# Altium project PCB_Project_MOPA_D.PrjPcb (part 1 of 2)
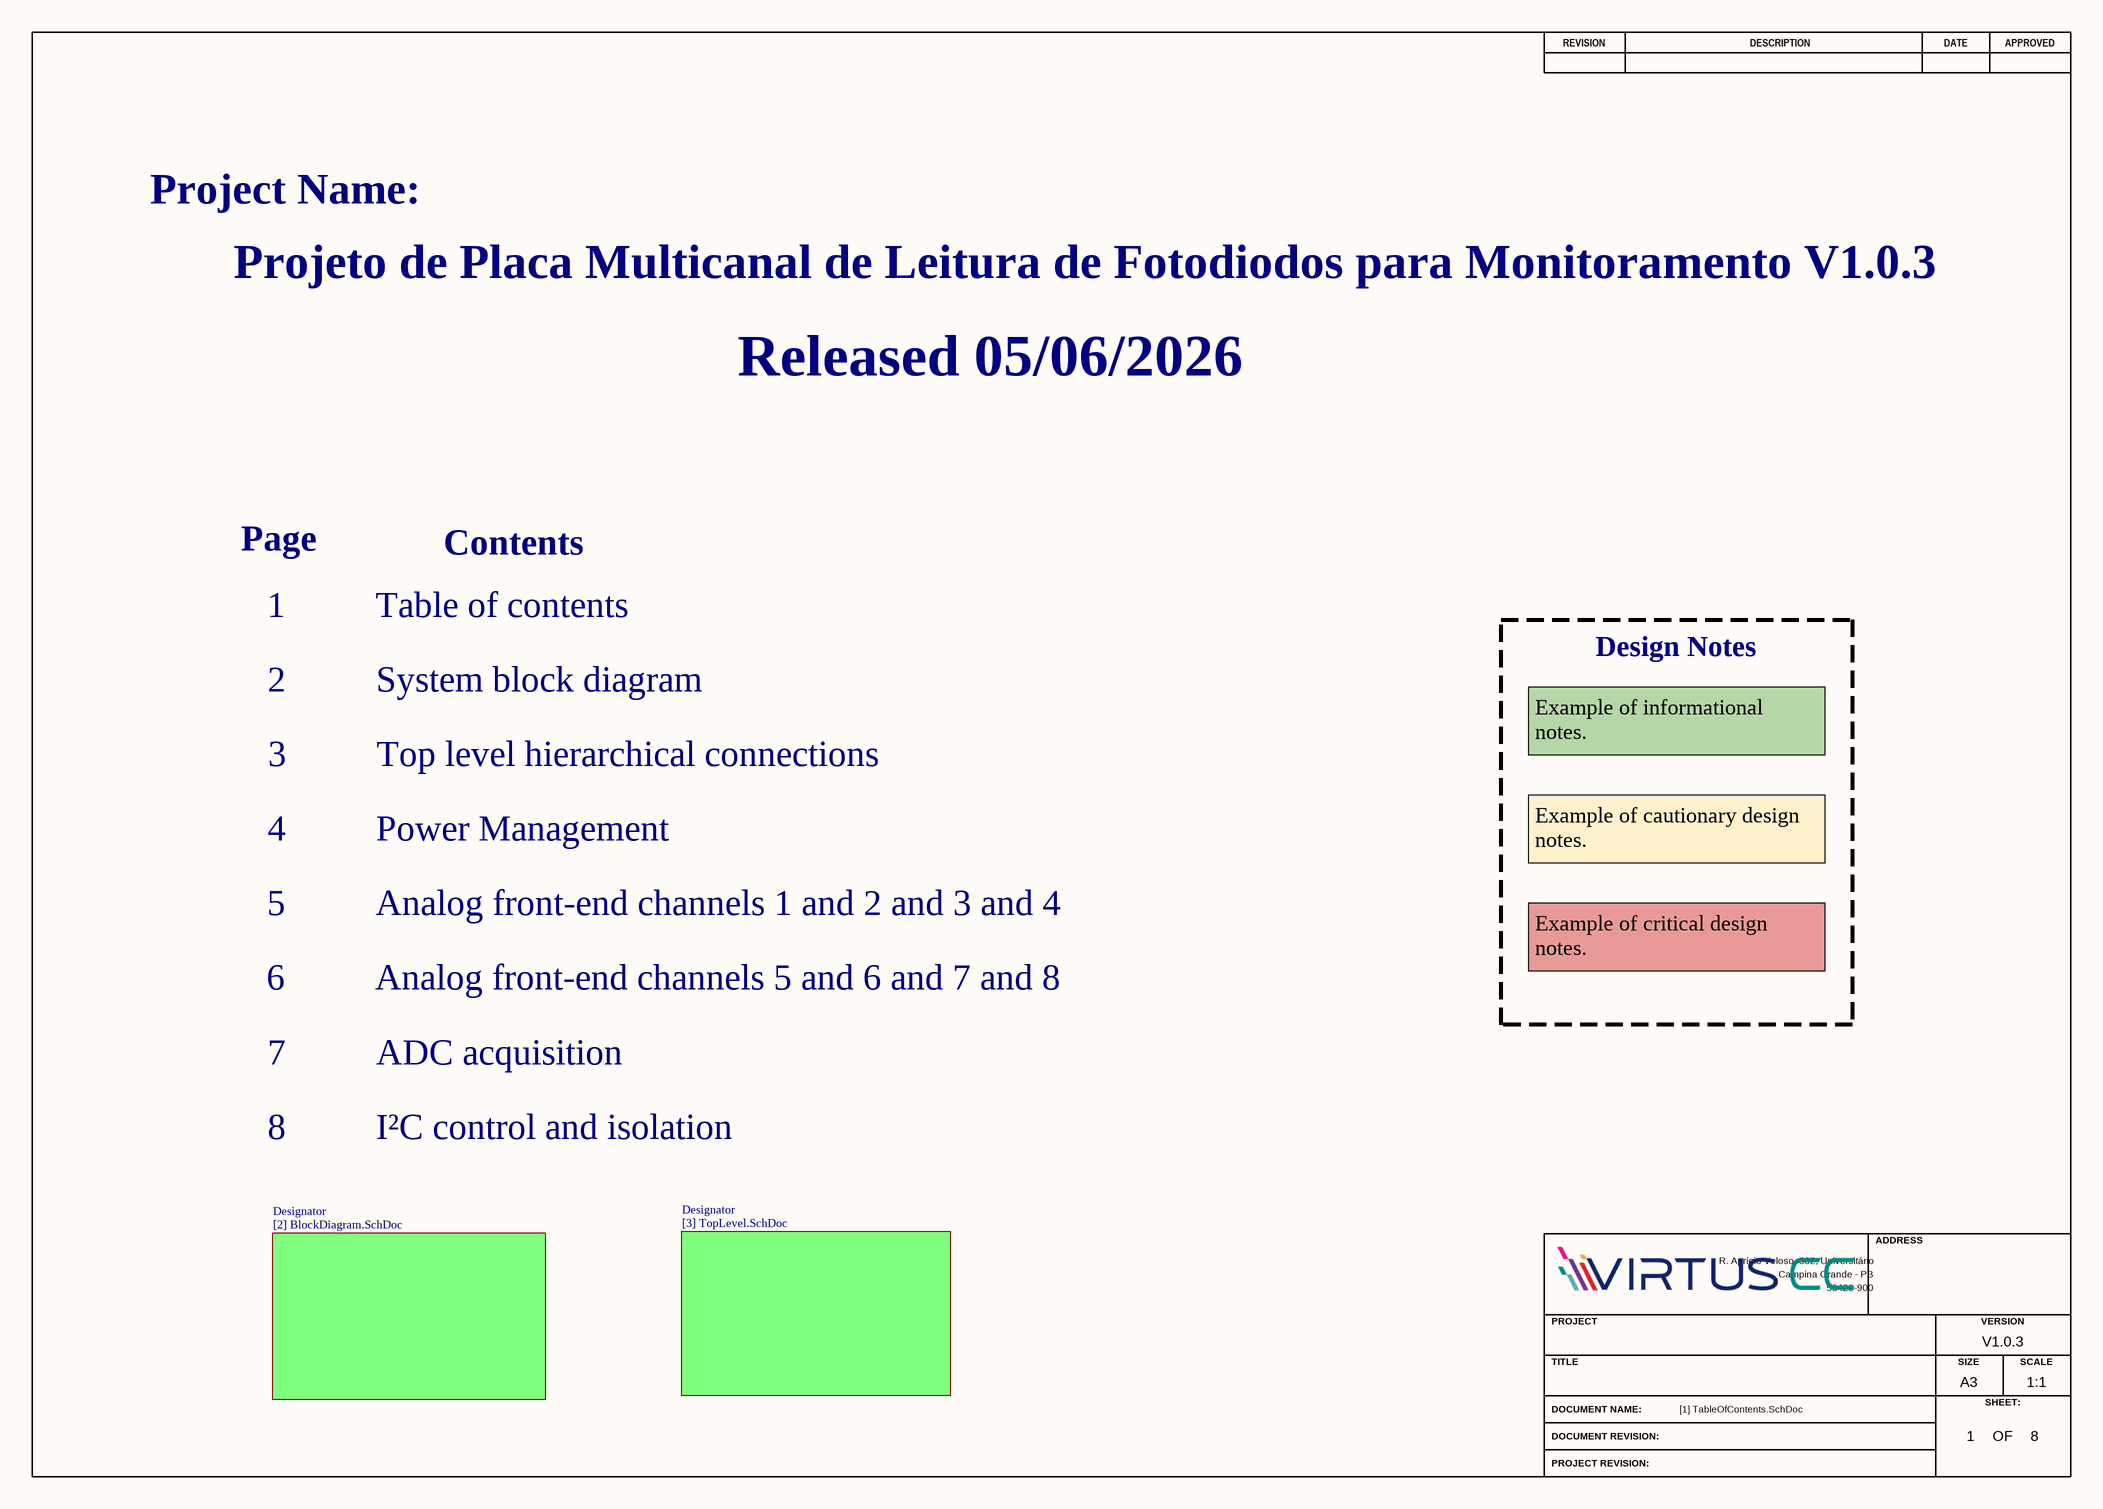
[diagram p0: [1] TableOfContents.SchDoc]
Version: V1.0.3
8 sheets, 129 parts. Net scope: hierarchical (ports join the sheet entries above them; power ports are global).
Board file: PCB_MOPA.PcbDoc
Sheets:
  [1] TableOfContents.SchDoc
    Designator = [2] BlockDiagram.SchDoc
    Designator = [3] TopLevel.SchDoc
      [5] AnalogChannels_1_2_3_4 = [5] AnalogChannels_1_2_3_4.SchDoc
      [6] AnalogChannels_5_6_7_8 = [6] AnalogChannels_5_6_7_8.SchDoc
      [4] PowerManagement = [4] PowerManagement.SchDoc
      [8] I2C_Control = [8] I2C_Control.SchDoc
      [7] ADC_Acquisition = [7] ADC_Acquisition.SchDoc

## Sheet [1] TableOfContents.SchDoc: =DocumentName
size A3; Organization: ORGANIZATION; Address1: R. Aprígio Veloso, 882, Universitário; Address2: Campina Grande - PB; Address3: 58429-900; DocumentNumber: 1; Revision: -; SheetNumber: 1; SheetTotal: 8; Project: PCB_Project_MOPA_D.PrjPcb; ENG_DATE: --/--/--; DSN_DATE: --/--/--; CHK_DATE: --/--/--; SCH_SCALE: 1:1

### Sub-sheets
Designator = [2] BlockDiagram.SchDoc: no entries
Designator = [3] TopLevel.SchDoc: no entries

### Notes on the sheet
- Project Name:
- Released 05/06/2026
- Page
- Contents
- 1          Table of contents
- Design Notes
- 2          System block diagram
- 3          Top level hierarchical connections
- Example of informational notes.
- 4          Power Management
- Example of cautionary design notes.
- 5          Analog front-end channels 1 and 2 and 3 and 4
- 6          Analog front-end channels 5 and 6 and 7 and 8
- Example of critical design notes.
- 7          ADC acquisition
- 8          I²C control and isolation
- REVISION
- DESCRIPTION
- DATE
- APPROVED
- ADDRESS
- PROJECT
- VERSION
- TITLE
- A3
- SIZE
- SCALE
- DOCUMENT NAME:
- DOCUMENT REVISION:
- OF
- SHEET:
- PROJECT REVISION:

## Sheet [2] BlockDiagram.SchDoc: =DocumentName
size A3; Organization: ORGANIZATION; Address1: R. Aprígio Veloso, 882, Universitário; Address2: Campina Grande - PB; Address3: 58429-900; DocumentNumber: 2; Revision: -; SheetNumber: 2; SheetTotal: 8; Project: PCB_Project_MOPA_D.PrjPcb; ENG_DATE: --/--/--; DSN_DATE: --/--/--; CHK_DATE: --/--/--; SCH_SCALE: 1:1
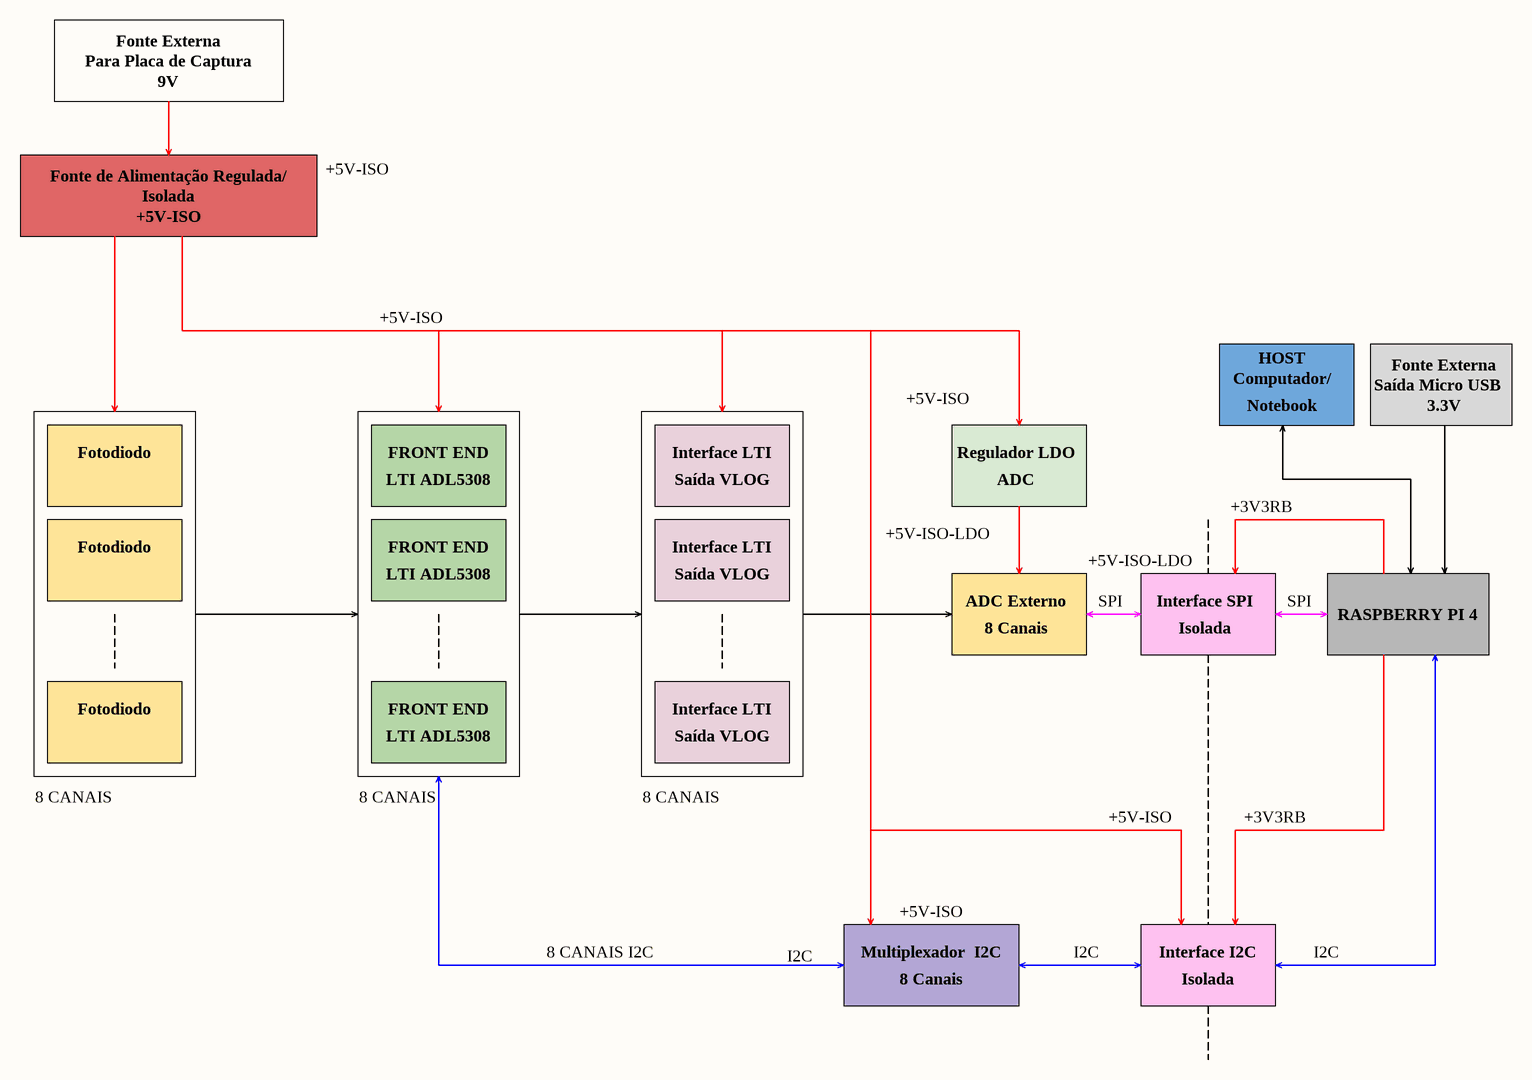
[diagram p1: [2] BlockDiagram.SchDoc]

### Notes on the sheet
- Fonte Externa
- Para Placa de Captura
- 9V
- Fonte de Alimentação Regulada/
- Isolada
- +5V-ISO
- HOST
- Computador/
- Notebook
- Saída Micro USB
- 3.3V
- Fotodiodo
- FRONT END
- LTI ADL5308
- Interface LTI
- Saída VLOG
- Regulador LDO
- ADC
- +5V-ISO-LDO
- +3V3RB
- ADC Externo
- SPI
- Interface SPI
- RASPBERRY PI 4
- 8 Canais
- 8 CANAIS
- 8 CANAIS I2C
- I2C
- Multiplexador  I2C
- Interface I2C
- REVISION
- DESCRIPTION
- DATE
- APPROVED
- ADDRESS
- PROJECT
- VERSION
- TITLE
- A3
- SIZE
- SCALE
- DOCUMENT NAME:
- DOCUMENT REVISION:
- OF
- SHEET:
- PROJECT REVISION:

## Sheet [3] TopLevel.SchDoc: =DocumentName
size A3; Organization: ORGANIZATION; Address1: R. Aprígio Veloso, 882, Universitário; Address2: Campina Grande - PB; Address3: 58429-900; DocumentNumber: 3; Revision: -; SheetNumber: 3; SheetTotal: 8; Project: PCB_Project_MOPA_D.PrjPcb; ENG_DATE: --/--/--; DSN_DATE: --/--/--; CHK_DATE: --/--/--; SCH_SCALE: 1:1
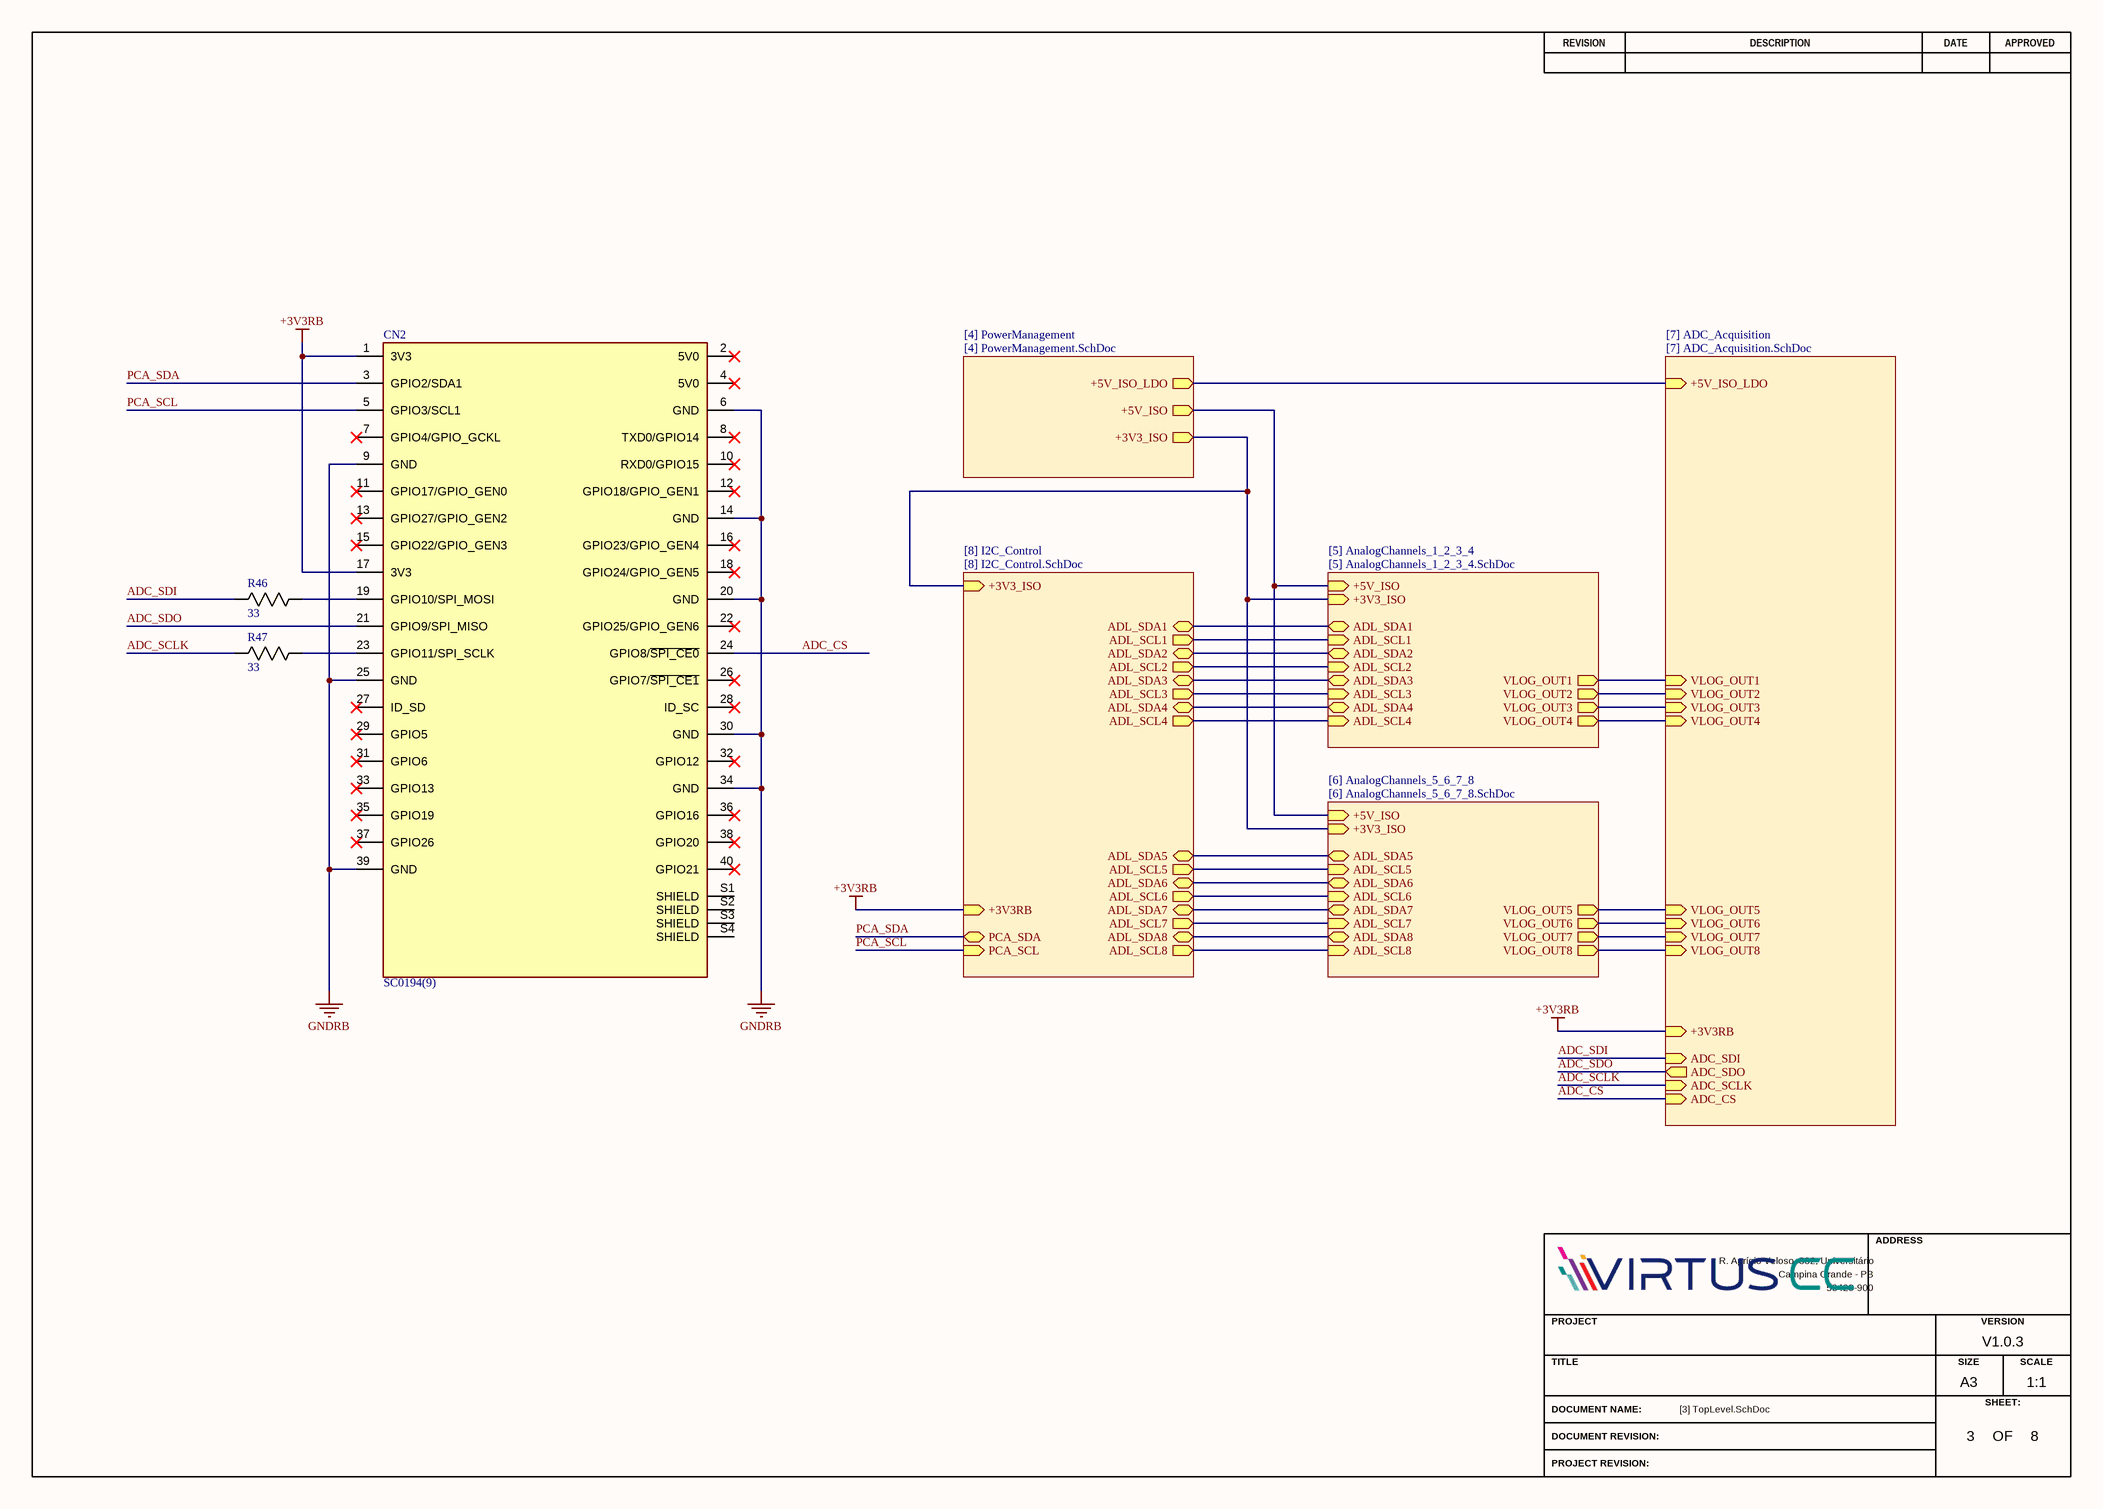
[diagram p2: [3] TopLevel.SchDoc]

### Parts
CN2  SC0194(9)  [RPI_SHIELD_CONNECTOR]
R46  value 33  [RESC1005X40N]  (hidden comment: RC0402FR-0733RL)
R47  value 33  [RESC1005X40N]  (hidden comment: RC0402FR-0733RL)

### Sub-sheets
[4] PowerManagement = [4] PowerManagement.SchDoc: +5V_ISO_LDO (out), +5V_ISO (out), +3V3_ISO (out)
[5] AnalogChannels_1_2_3_4 = [5] AnalogChannels_1_2_3_4.SchDoc: VLOG_OUT3 (out), ADL_SCL3 (in), ADL_SCL2 (in), VLOG_OUT1 (out), +5V_ISO (in), ADL_SCL4 (in), VLOG_OUT2 (out), ADL_SDA3 (bidir), ADL_SDA2 (bidir), VLOG_OUT4 (out), ADL_SCL1 (in), ADL_SDA1 (bidir), ADL_SDA4 (bidir), +3V3_ISO (in)
[6] AnalogChannels_5_6_7_8 = [6] AnalogChannels_5_6_7_8.SchDoc: +5V_ISO (in), ADL_SDA5 (bidir), ADL_SCL8 (in), ADL_SCL6 (in), ADL_SDA6 (bidir), ADL_SDA7 (bidir), ADL_SDA8 (bidir), VLOG_OUT6 (out), ADL_SCL7 (in), ADL_SCL5 (in), VLOG_OUT5 (out), VLOG_OUT7 (out), VLOG_OUT8 (out), +3V3_ISO (in)
[7] ADC_Acquisition = [7] ADC_Acquisition.SchDoc: VLOG_OUT1 (in), VLOG_OUT7 (in), VLOG_OUT6 (in), VLOG_OUT2 (in), +5V_ISO_LDO (in), VLOG_OUT8 (in), VLOG_OUT5 (in), VLOG_OUT3 (in), VLOG_OUT4 (in), ADC_SDO (out), +3V3RB (in), ADC_CS (in), ADC_SDI (in), ADC_SCLK (in)
[8] I2C_Control = [8] I2C_Control.SchDoc: ADL_SDA5 (bidir), ADL_SCL3 (out), ADL_SCL1 (out), ADL_SDA4 (bidir), ADL_SCL6 (out), ADL_SDA8 (bidir), ADL_SCL8 (out), ADL_SCL4 (out), ADL_SDA7 (bidir), ADL_SDA2 (bidir), ADL_SDA1 (bidir), ADL_SCL2 (out), ADL_SDA3 (bidir), ADL_SDA6 (bidir), ADL_SCL5 (out), ADL_SCL7 (out), PCA_SDA (bidir), PCA_SCL (in), +3V3RB (in), +3V3_ISO (in)

### Nets
+3V3_ISO: sheet [5] AnalogChannels_1_2_3_4/+3V3_ISO, sheet [6] AnalogChannels_5_6_7_8/+3V3_ISO, sheet [4] PowerManagement/+3V3_ISO, sheet [8] I2C_Control/+3V3_ISO
+3V3RB: CN2.1(3V3) CN2.17(3V3) ; sheet [8] I2C_Control/+3V3RB, sheet [7] ADC_Acquisition/+3V3RB
+5V_ISO: sheet [5] AnalogChannels_1_2_3_4/+5V_ISO, sheet [6] AnalogChannels_5_6_7_8/+5V_ISO, sheet [4] PowerManagement/+5V_ISO
+5V_ISO_LDO: sheet [4] PowerManagement/+5V_ISO_LDO, sheet [7] ADC_Acquisition/+5V_ISO_LDO
GNDRB: CN2.6(GND) CN2.9(GND) CN2.14(GND) CN2.20(GND) CN2.25(GND) CN2.30(GND) CN2.34(GND) CN2.39(GND)
ADC_CS: CN2.24(GPIO8/~{SPI_CE0}) ; sheet [7] ADC_Acquisition/ADC_CS
ADC_SCLK: R47.2 ; sheet [7] ADC_Acquisition/ADC_SCLK
ADC_SDI: R46.2 ; sheet [7] ADC_Acquisition/ADC_SDI
ADC_SDO: CN2.21(GPIO9/SPI_MISO) ; sheet [7] ADC_Acquisition/ADC_SDO
PCA_SCL: CN2.5(GPIO3/SCL1) ; sheet [8] I2C_Control/PCA_SCL
PCA_SDA: CN2.3(GPIO2/SDA1) ; sheet [8] I2C_Control/PCA_SDA
VLOG_OUT1: sheet [5] AnalogChannels_1_2_3_4/VLOG_OUT1, sheet [7] ADC_Acquisition/VLOG_OUT1
VLOG_OUT2: sheet [5] AnalogChannels_1_2_3_4/VLOG_OUT2, sheet [7] ADC_Acquisition/VLOG_OUT2
VLOG_OUT3: sheet [5] AnalogChannels_1_2_3_4/VLOG_OUT3, sheet [7] ADC_Acquisition/VLOG_OUT3
VLOG_OUT4: sheet [5] AnalogChannels_1_2_3_4/VLOG_OUT4, sheet [7] ADC_Acquisition/VLOG_OUT4
VLOG_OUT5: sheet [6] AnalogChannels_5_6_7_8/VLOG_OUT5, sheet [7] ADC_Acquisition/VLOG_OUT5
VLOG_OUT6: sheet [6] AnalogChannels_5_6_7_8/VLOG_OUT6, sheet [7] ADC_Acquisition/VLOG_OUT6
VLOG_OUT7: sheet [6] AnalogChannels_5_6_7_8/VLOG_OUT7, sheet [7] ADC_Acquisition/VLOG_OUT7
VLOG_OUT8: sheet [6] AnalogChannels_5_6_7_8/VLOG_OUT8, sheet [7] ADC_Acquisition/VLOG_OUT8
NetCN2_19: CN2.19(GPIO10/SPI_MOSI) R46.1
NetCN2_23: CN2.23(GPIO11/SPI_SCLK) R47.1
NetR7_2: sheet [5] AnalogChannels_1_2_3_4/ADL_SCL2, sheet [8] I2C_Control/ADL_SCL2
NetR8_2: sheet [5] AnalogChannels_1_2_3_4/ADL_SDA2, sheet [8] I2C_Control/ADL_SDA2
NetR9_2: sheet [5] AnalogChannels_1_2_3_4/ADL_SCL1, sheet [8] I2C_Control/ADL_SCL1
NetR10_2: sheet [5] AnalogChannels_1_2_3_4/ADL_SDA1, sheet [8] I2C_Control/ADL_SDA1
NetR15_2: sheet [5] AnalogChannels_1_2_3_4/ADL_SCL4, sheet [8] I2C_Control/ADL_SCL4
NetR16_2: sheet [5] AnalogChannels_1_2_3_4/ADL_SDA4, sheet [8] I2C_Control/ADL_SDA4
NetR17_2: sheet [5] AnalogChannels_1_2_3_4/ADL_SCL3, sheet [8] I2C_Control/ADL_SCL3
NetR18_2: sheet [5] AnalogChannels_1_2_3_4/ADL_SDA3, sheet [8] I2C_Control/ADL_SDA3
NetR23_2: sheet [6] AnalogChannels_5_6_7_8/ADL_SCL5, sheet [8] I2C_Control/ADL_SCL5
NetR24_2: sheet [6] AnalogChannels_5_6_7_8/ADL_SDA5, sheet [8] I2C_Control/ADL_SDA5
NetR25_2: sheet [6] AnalogChannels_5_6_7_8/ADL_SCL6, sheet [8] I2C_Control/ADL_SCL6
NetR26_2: sheet [6] AnalogChannels_5_6_7_8/ADL_SDA6, sheet [8] I2C_Control/ADL_SDA6
NetR31_2: sheet [6] AnalogChannels_5_6_7_8/ADL_SCL8, sheet [8] I2C_Control/ADL_SCL8
NetR32_2: sheet [6] AnalogChannels_5_6_7_8/ADL_SDA8, sheet [8] I2C_Control/ADL_SDA8
NetR33_2: sheet [6] AnalogChannels_5_6_7_8/ADL_SCL7, sheet [8] I2C_Control/ADL_SCL7
NetR34_2: sheet [6] AnalogChannels_5_6_7_8/ADL_SDA7, sheet [8] I2C_Control/ADL_SDA7

Not connected (* = marked no-connect by the designer): CN2 2(5V0)* 4(5V0)* 7(GPIO4/GPIO_GCKL)* 8(TXD0/GPIO14)* 10(RXD0/GPIO15)* 11(GPIO17/GPIO_GEN0)* 12(GPIO18/GPIO_GEN1)* 13(GPIO27/GPIO_GEN2)* 15(GPIO22/GPIO_GEN3)* 16(GPIO23/GPIO_GEN4)* 18(GPIO24/GPIO_GEN5)* 22(GPIO25/GPIO_GEN6)* 26(GPIO7/~{SPI_CE1})* 27(ID_SD)* 28(ID_SC)* 29(GPIO5)* 31(GPIO6)* 32(GPIO12)* 33(GPIO13)* 35(GPIO19)* 36(GPIO16)* 37(GPIO26)* 38(GPIO20)* 40(GPIO21)* S1(SHIELD) S2(SHIELD) S3(SHIELD) S4(SHIELD)

### Notes on the sheet
- REVISION
- DESCRIPTION
- DATE
- APPROVED
- ADDRESS
- PROJECT
- VERSION
- TITLE
- A3
- SIZE
- SCALE
- DOCUMENT NAME:
- DOCUMENT REVISION:
- OF
- SHEET:
- PROJECT REVISION:

### Library data of the parts
CN2 = SC0194(9): The Raspberry Pi 4 Model B SC0194(9) single board computer features a Broadcom BCM2711 ARM Cortex-A72 quad-core processor operating at 1.5GHz, making it a powerful choice for embedded computing applications. Equipped with 4GB of RAM and a variety of conne; SnapEDA_Link: https://www.snapeda.com/parts/SC0194(9)/Raspberry+Pi/view-part/?ref=snap; Package: None; Value: *; MF: Raspberry Pi; MP: SC0194(9); Check_prices: https://www.snapeda.com/parts/SC0194(9)/Raspberry+Pi/view-part/?ref=eda
R46 R47 = RC0402FR-0733RL: 33 Ohms ±1% 0.063W, 1/16W Chip Resistor 0402 (1005 Metric) Moisture Resistant Thick Film; Manufacturer_Name: Yageo; Copyright: Copyright (C) 2025 Ultra Librarian. All rights reserved.; Manufacturer_Part_Number: RC0402FR-0733RL; Supplier 1: DigiKey; Supplier Part Number 1: 311-33.0LRCT-ND; Datasheet Link: https://yageogroup.com/content/datasheet/asset/file/PYU-RC_GROUP_51_ROHS_L

## Sheet [5] AnalogChannels_1_2_3_4.SchDoc: =DocumentName
size A3; Organization: ORGANIZATION; Address1: R. Aprígio Veloso, 882, Universitário; Address2: Campina Grande - PB; Address3: 58429-900; DocumentNumber: 5; Revision: -; SheetNumber: 5; SheetTotal: 8; Project: PCB_Project_MOPA_D.PrjPcb; ENG_DATE: --/--/--; DSN_DATE: --/--/--; CHK_DATE: --/--/--; SCH_SCALE: 1:1
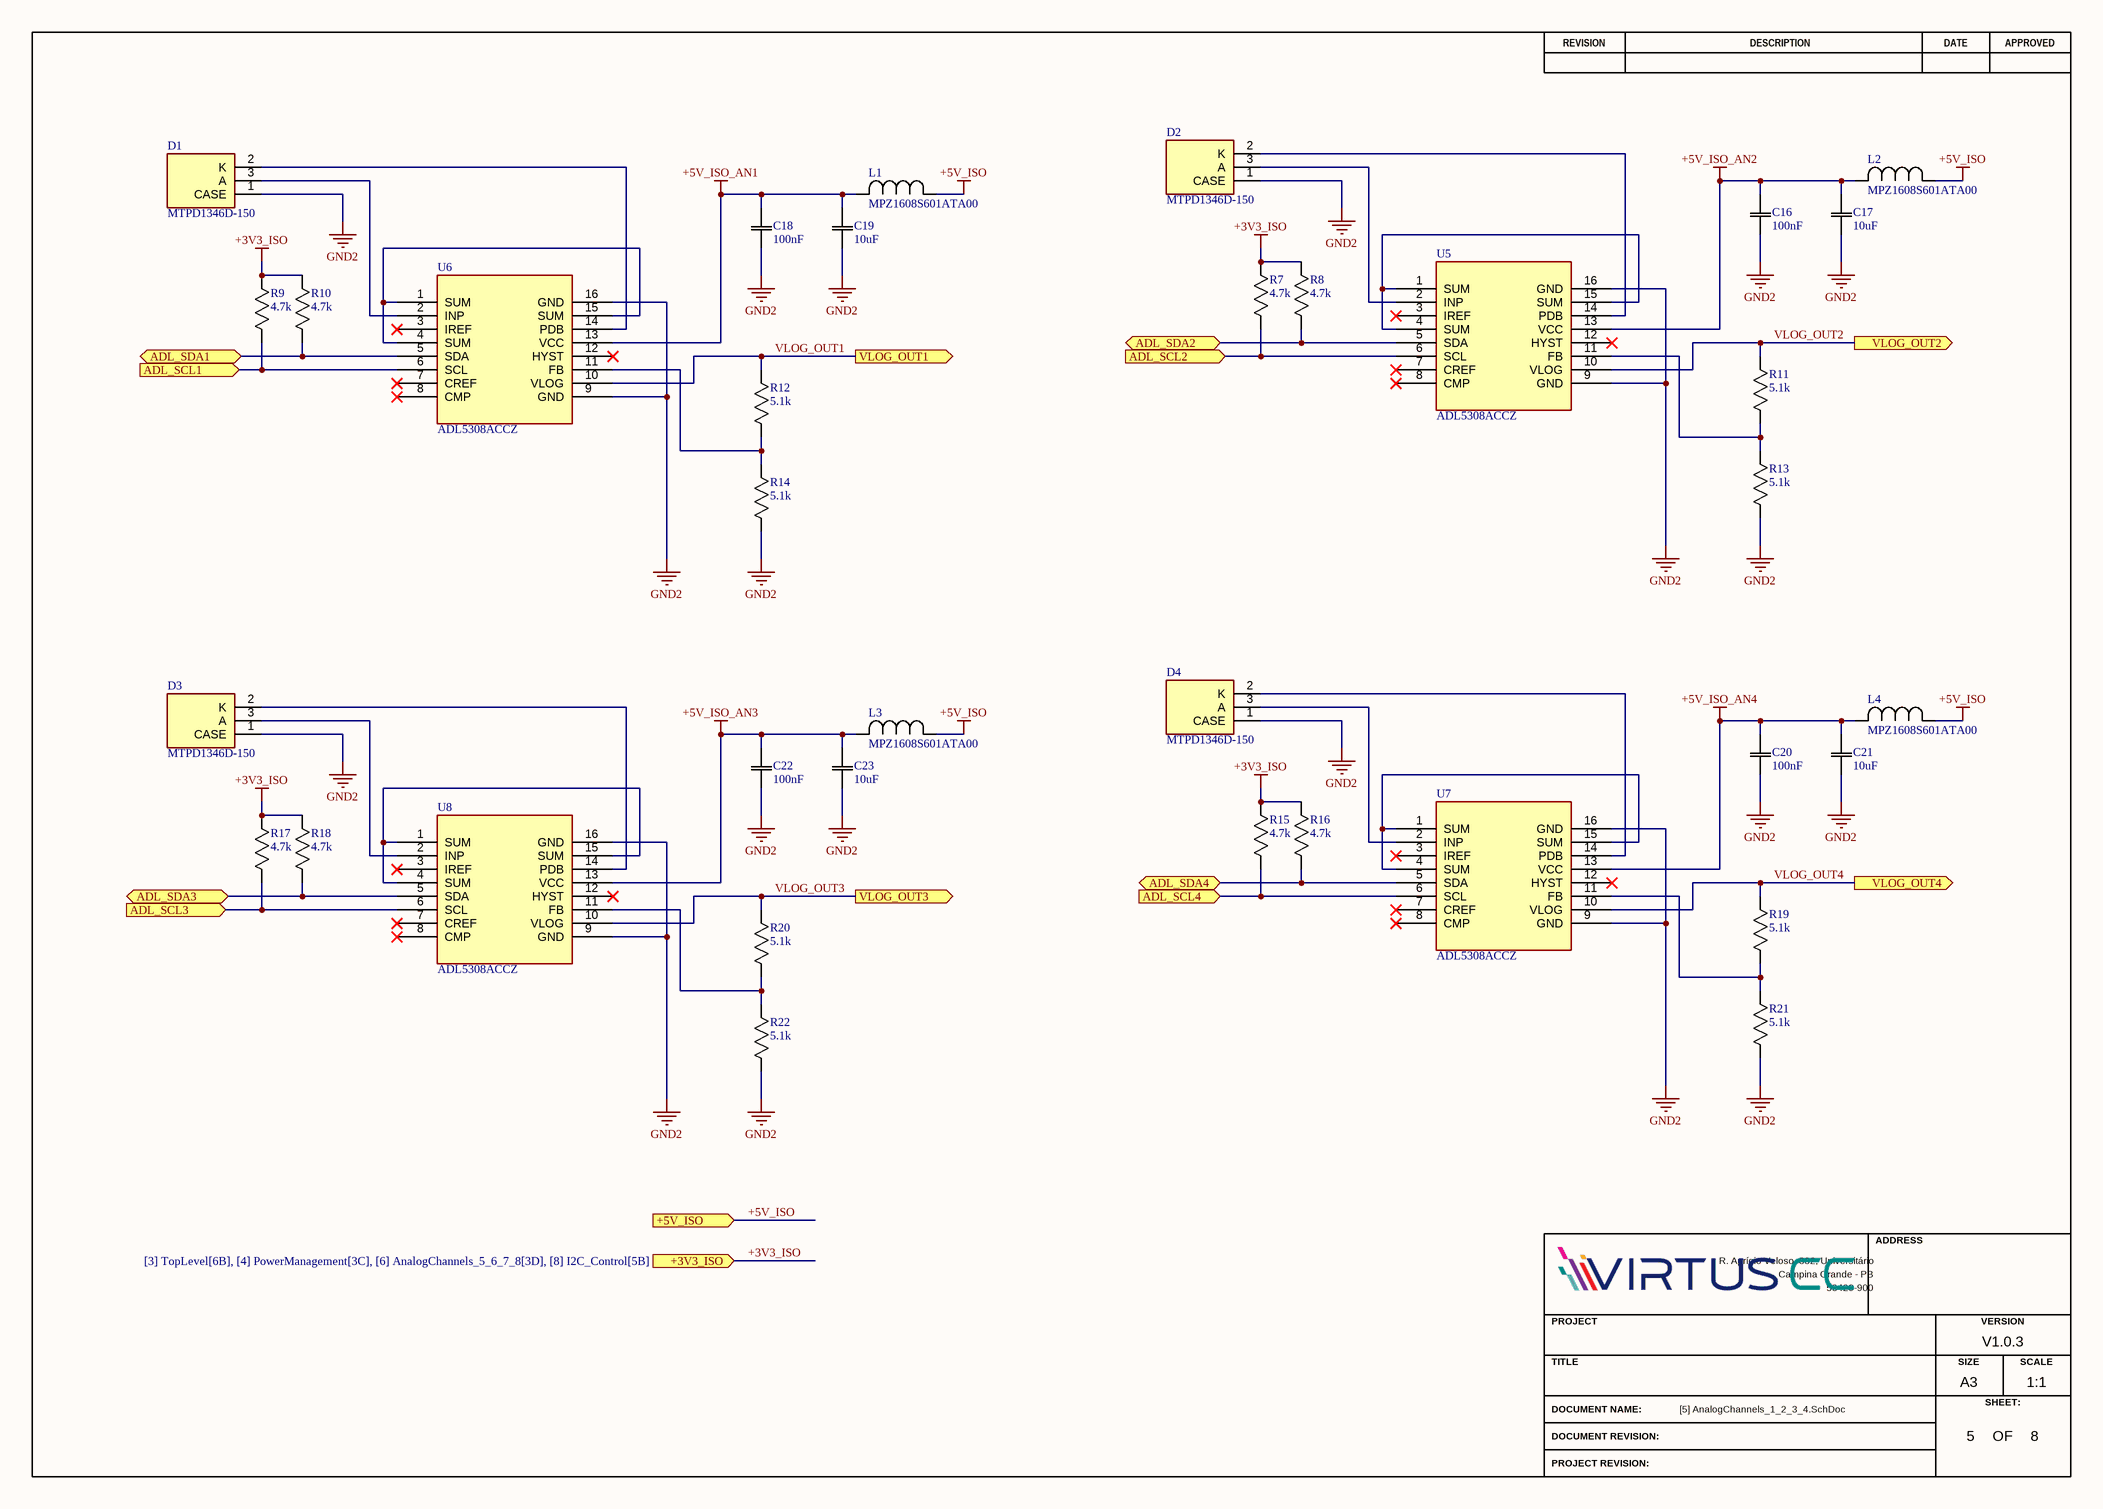
[diagram p3: [5] AnalogChannels_1_2_3_4.SchDoc]

### Parts
C16  value 100nF  [CAPC1005X40N]  (hidden comment: GCM155R71H104KE02D)
C17  value 10uF  [CAPC1005X40N]  (hidden comment: GRT155R61A106ME13D)
C18  value 100nF  [CAPC1005X40N]  (hidden comment: GCM155R71H104KE02D)
C19  value 10uF  [CAPC1005X40N]  (hidden comment: GRT155R61A106ME13D)
C20  value 100nF  [CAPC1005X40N]  (hidden comment: GCM155R71H104KE02D)
C21  value 10uF  [CAPC1005X40N]  (hidden comment: GRT155R61A106ME13D)
C22  value 100nF  [CAPC1005X40N]  (hidden comment: GCM155R71H104KE02D)
C23  value 10uF  [CAPC1005X40N]  (hidden comment: GRT155R61A106ME13D)
D1  MTPD1346D-150  [TO127P540X1680-3N]
D2  MTPD1346D-150  [TO127P540X1680-3N]
D3  MTPD1346D-150  [TO127P540X1680-3N]
D4  MTPD1346D-150  [TO127P540X1680-3N]
L1  MPZ1608S601ATA00  [INDC1608X06N]
L2  MPZ1608S601ATA00  [INDC1608X06N]
L3  MPZ1608S601ATA00  [INDC1608X06N]
L4  MPZ1608S601ATA00  [INDC1608X06N]
R7  value 4.7k  [RESC1005X40N]  (hidden comment: RC0402FR-074K7L)
R8  value 4.7k  [RESC1005X40N]  (hidden comment: RC0402FR-074K7L)
R9  value 4.7k  [RESC1005X40N]  (hidden comment: RC0402FR-074K7L)
R10  value 4.7k  [RESC1005X40N]  (hidden comment: RC0402FR-074K7L)
R11  value 5.1k  [RESC1005X40N]  (hidden comment: RC0402FR-075K1L)
R12  value 5.1k  [RESC1005X40N]  (hidden comment: RC0402FR-075K1L)
R13  value 5.1k  [RESC1005X40N]  (hidden comment: RC0402FR-075K1L)
R14  value 5.1k  [RESC1005X40N]  (hidden comment: RC0402FR-075K1L)
R15  value 4.7k  [RESC1005X40N]  (hidden comment: RC0402FR-074K7L)
R16  value 4.7k  [RESC1005X40N]  (hidden comment: RC0402FR-074K7L)
R17  value 4.7k  [RESC1005X40N]  (hidden comment: RC0402FR-074K7L)
R18  value 4.7k  [RESC1005X40N]  (hidden comment: RC0402FR-074K7L)
R19  value 5.1k  [RESC1005X40N]  (hidden comment: RC0402FR-075K1L)
R20  value 5.1k  [RESC1005X40N]  (hidden comment: RC0402FR-075K1L)
R21  value 5.1k  [RESC1005X40N]  (hidden comment: RC0402FR-075K1L)
R22  value 5.1k  [RESC1005X40N]  (hidden comment: RC0402FR-075K1L)
U5  ADL5308ACCZ  [CC-14-4_ADI]
U6  ADL5308ACCZ  [CC-14-4_ADI]
U7  ADL5308ACCZ  [CC-14-4_ADI]
U8  ADL5308ACCZ  [CC-14-4_ADI]

### Ports
+3V3_ISO (in, see [3] TopLevel[6B], [4] PowerManagement[3C], [6] AnalogChannels_5_6_7_8[3D], [8] I2C_Control[5B]), +5V_ISO (in, see [3] TopLevel[6B], [4] PowerManagement[4B], [6] AnalogChannels_5_6_7_8[3D]), ADL_SCL1 (in, see [3] TopLevel[6B], [8] I2C_Control[3A]), ADL_SCL2 (in, see [3] TopLevel[6B], [8] I2C_Control[3B]), ADL_SCL3 (in, see [3] TopLevel[6B], [8] I2C_Control[3B]), ADL_SCL4 (in, see [3] TopLevel[6B], [8] I2C_Control[3B]), ADL_SDA1 (bidir, see [3] TopLevel[6B], [8] I2C_Control[3A]), ADL_SDA2 (bidir, see [3] TopLevel[6B], [8] I2C_Control[3B]), ADL_SDA3 (bidir, see [3] TopLevel[6B], [8] I2C_Control[3B]), ADL_SDA4 (bidir, see [3] TopLevel[6B], [8] I2C_Control[3B]), VLOG_OUT1 (out, see [3] TopLevel[7B], [7] ADC_Acquisition[3A]), VLOG_OUT2 (out, see [3] TopLevel[7B], [7] ADC_Acquisition[3A]), VLOG_OUT3 (out, see [3] TopLevel[7B], [7] ADC_Acquisition[3A]), VLOG_OUT4 (out, see [3] TopLevel[7B], [7] ADC_Acquisition[3A])

### Nets
+3V3_ISO: R7.1 R8.1 R9.1 R10.1 R15.1 R16.1 R17.1 R18.1 ; port +3V3_ISO
+5V_ISO: L1.1 L2.1 L3.1 L4.1 ; port +5V_ISO
+5V_ISO_AN1: C18.2 C19.2 L1.2 U6.13(VCC)
+5V_ISO_AN2: C16.2 C17.2 L2.2 U5.13(VCC)
+5V_ISO_AN3: C22.2 C23.2 L3.2 U8.13(VCC)
+5V_ISO_AN4: C20.2 C21.2 L4.2 U7.13(VCC)
GND2: C16.1 C17.1 C18.1 C19.1 C20.1 C21.1 C22.1 C23.1 D1.1(CASE) D2.1(CASE) D3.1(CASE) D4.1(CASE) R13.2 R14.2 R21.2 R22.2 U5.9(GND) U5.16(GND) U6.9(GND) U6.16(GND) U7.9(GND) U7.16(GND) U8.9(GND) U8.16(GND)
VLOG_OUT1: R12.1 U6.10(VLOG) ; port VLOG_OUT1
VLOG_OUT2: R11.1 U5.10(VLOG) ; port VLOG_OUT2
VLOG_OUT3: R20.1 U8.10(VLOG) ; port VLOG_OUT3
VLOG_OUT4: R19.1 U7.10(VLOG) ; port VLOG_OUT4
NetD1_2: D1.2(K) U6.14(PDB)
NetD1_3: D1.3(A) U6.2(INP)
NetD2_2: D2.2(K) U5.14(PDB)
NetD2_3: D2.3(A) U5.2(INP)
NetD3_2: D3.2(K) U8.14(PDB)
NetD3_3: D3.3(A) U8.2(INP)
NetD4_2: D4.2(K) U7.14(PDB)
NetD4_3: D4.3(A) U7.2(INP)
NetR7_2: R7.2 U5.6(SCL) ; port ADL_SCL2
NetR8_2: R8.2 U5.5(SDA) ; port ADL_SDA2
NetR9_2: R9.2 U6.6(SCL) ; port ADL_SCL1
NetR10_2: R10.2 U6.5(SDA) ; port ADL_SDA1
NetR11_2: R11.2 R13.1 U5.11(FB)
NetR12_2: R12.2 R14.1 U6.11(FB)
NetR15_2: R15.2 U7.6(SCL) ; port ADL_SCL4
NetR16_2: R16.2 U7.5(SDA) ; port ADL_SDA4
NetR17_2: R17.2 U8.6(SCL) ; port ADL_SCL3
NetR18_2: R18.2 U8.5(SDA) ; port ADL_SDA3
NetR19_2: R19.2 R21.1 U7.11(FB)
NetR20_2: R20.2 R22.1 U8.11(FB)
NetU5_1: U5.1(SUM) U5.4(SUM) U5.15(SUM)
NetU6_1: U6.1(SUM) U6.4(SUM) U6.15(SUM)
NetU7_1: U7.1(SUM) U7.4(SUM) U7.15(SUM)
NetU8_1: U8.1(SUM) U8.4(SUM) U8.15(SUM)

Not connected (* = marked no-connect by the designer): U5 3(IREF)* 7(CREF)* 8(CMP)* 12(HYST)*; U6 3(IREF)* 7(CREF)* 8(CMP)* 12(HYST)*; U7 3(IREF)* 7(CREF)* 8(CMP)* 12(HYST)*; U8 3(IREF)* 7(CREF)* 8(CMP)* 12(HYST)*

### Notes on the sheet
- REVISION
- DESCRIPTION
- DATE
- APPROVED
- ADDRESS
- PROJECT
- VERSION
- TITLE
- A3
- SIZE
- SCALE
- DOCUMENT NAME:
- DOCUMENT REVISION:
- OF
- SHEET:
- PROJECT REVISION:

### Library data of the parts
C16 C18 C20 C22 = GCM155R71H104KE02D: 0.1 µF ±10% 50V Ceramic Capacitor X7R 0402 (1005 Metric); Manufacturer_Name: Murata; Copyright: Copyright (C) 2026 Ultra Librarian. All rights reserved.; Manufacturer_Part_Number: GCM155R71H104KE02D; Supplier 1: DigiKey; Supplier Part Number 1: 490-10672-1-ND; Datasheet Link: https://search.murata.co.jp/Ceramy/image/img/A01X/G101/ENG/GCM155R71H104KE02-01.pdf
C17 C19 C21 C23 = GRT155R61A106ME13D: 10 µF ±20% 10V Ceramic Capacitor X5R 0402 (1005 Metric); Manufacturer_Name: Murata; Copyright: Copyright (C) 2026 Ultra Librarian. All rights reserved.; Manufacturer_Part_Number: GRT155R61A106ME13D; Supplier 1: DigiKey; Supplier Part Number 1: 490-GRT155R61A106ME13DCT-ND; Datasheet Link: https://search.murata.co.jp/Ceramy/image/img/A01X/G101/ENG/GRT155R61A106ME13-01A.pdf
D1-D4 = MTPD1346D-150: Photodiode 1300nm TO-46-3 Lens Top Metal Can; Manufacturer_Name: Marktech Optoelectronics; SnapEDA_Link: https://www.snapeda.com/parts/MTPD1346D-150/Marktech%20Optoelectronics/view-part/2762424/?ref=snap; Value: MTPD1346D-150; Package: TO-46-3 Marktech Optoelectronics; Supplier 1: Digikey; Supplier Part Number 1: 1125-1327-ND; Manufacturer_Part_Number: MTPD1346D-150; Datasheet Link: https://specs.marktechopto.com/pdf/products/datasheet/MTPD1346D-150.pdf
L1-L4 = MPZ1608S601ATA00: INDUCTOR; SMT (0603); FERRITE-BEAD; 600; TOL=+/-25%; 1A; -55 DEGC TO +125 DEGC; Manufacturer_Name: TDK; Copyright: Copyright (C) 2026 Ultra Librarian. All rights reserved.; Manufacturer_Part_Number: MPZ1608S601ATA00; Supplier 1: DigiKey; Supplier Part Number 1: 445-MPZ1608S601ATA00CT-ND; Supplier 2: Mouser; Supplier Part Number 2: 810-MPZ1608S601ATA00; Value: MPZ1608S601ATA00; Datasheet Link: https://product.tdk.com/en/system/files/dam/doc/product/emc/emc/beads/catalog/beads_commercial_power_mpz1608_en.pdf
R7-R10 R15-R18 = RC0402FR-074K7L: 4.7 kOhms ±1% 0.063W, 1/16W Chip Resistor 0402 (1005 Metric) Moisture Resistant Thick Film; Manufacturer_Name: Yageo; Copyright: Copyright (C) 2025 Ultra Librarian. All rights reserved.; Manufacturer_Part_Number: RC0402FR-074K7L; Supplier: Digikey; Supplier 1: DigiKey; Supplier Part Number 1: 311-4.7KLRCT-ND; Datasheet Link: https://yageogroup.com/content/datasheet/asset/file/PYU-RC_GROUP_51_ROHS_L
R11-R14 R19-R22 = RC0402FR-075K1L: 5.1 kOhms ±1% 0.063W, 1/16W Chip Resistor 0402 (1005 Metric) Moisture Resistant Thick Film; Manufacturer_Name: Yageo; Copyright: Copyright (C) 2025 Ultra Librarian. All rights reserved.; Manufacturer_Part_Number: RC0402FR-075K1L; Supplier: Digikey; Supplier 1: DigiKey; Supplier Part Number 1: 311-5.10KLRDKR-ND; Datasheet Link: https://yageogroup.com/content/datasheet/asset/file/PYU-RC_GROUP_51_ROHS_L
U5-U8 = ADL5308ACCZ: Logarithmic Converter, 105Deg C, Lga-Ep Rohs Compliant: Yes |Analog Devices, Inc. ADL5308ACCZ; Supplier: DigiKey; Supplier Part Number: 505-ADL5308ACCZ-ND; Category: Integrated Circuits (ICs); ComponentLink1URL: https://octopart.com:443/opatz8j6/c1?t=RA9GQZinOd29-lgehR1mMjPVps_pwNRaRgVV1YHzAIV5tl_XZCUSSAHitgBUBAYOkyHWZwhmuKnJMJd5RxR1VqE6m3xnviegrgL6shNBcrpF4LfPbYQ25RAGHFA1T9s0JOT-tl-QhPVPfLuNoqTz_6GGuiJfIxRC0S7r0DYLo04TjJESfYEQgeF8hwJXvZVADboypZr_g-Ea1XOnqBF-rgke93XuIMELyUETblR1X_UOadx82_PQ_RlLZBBqxzR00efRp-5niCJZslCBmJMmtGL_WYk9XjRWZNLGIjLbjTB1vQWuYu6Ttro&src-supplier=Analog+Devices; ComponentLink1Description: https://octopart.com:443/opatz8j6/c1?t=RA9GQZinOd29-lgehR1mMjPVps_pwNRaRgVV1YHzAIV5tl_XZCUSSAHitgBUBAYOkyHWZwhmuKnJMJd5RxR1VqE6m3xnviegrgL6shNBcrpF4LfPbYQ25RAGHFA1T9s0JOT-tl-QhPVPfLuNoqTz_6GGuiJfIxRC0S7r0DYLo04TjJESfYEQgeF8hwJXvZVADboypZr_g-Ea1XOnqBF-rgke93XuIMELyUETblR1X_UOadx82_PQ_RlLZBBqxzR00efRp-5niCJZslCBmJMmtGL_WYk9XjRWZNLGIjLbjTB1vQWuYu6Ttro&src-supplier=Analog+Devices; ComponentLink2URL: http://sigma.octopart.com:80/conflict_mineral_statement/Analog-Devices-company-33.pdf?src-supplier=Compliance+Statements; ComponentLink2Description: http://sigma.octopart.com:80/conflict_mineral_statement/Analog-Devices-company-33.pdf?src-supplier=Compliance+Statements; ComponentLink3URL: https://octopart.com:443/opatz8j6/c1?t=vRyEE9f1knuZsXfZ1EXV0igJkx_-mJPvDe2PRj94G0bMKfSINrZLJy9UxvHag1Ev7-JZTv2yES3irMYFchBWTpWzSwFH9zvLS0b9JOrPs9Pp2SMp_5VkKg4D-b9XM9N4Wk1jNVgkSgkhW8YH7ZyvkiIcKE_oeD_Hqil2BcqMABFddqLYAoPEQj49TJ_q7pMpzWSP-EVr2GWpI1kmAhJOGILngaZVyGxqQjwZ-ZoOI0z0mJCfXwlyMjB28ReNlNurs-8EToiXecBFaJGtKdUbF4KCBm4bpE5gucx16B8aD2Bl3eu5--byB1E&src-supplier=Compliance+Statements; ComponentLink3Description: https://octopart.com:443/opatz8j6/c1?t=vRyEE9f1knuZsXfZ1EXV0igJkx_-mJPvDe2PRj94G0bMKfSINrZLJy9UxvHag1Ev7-JZTv2yES3irMYFchBWTpWzSwFH9zvLS0b9JOrPs9Pp2SMp_5VkKg4D-b9XM9N4Wk1jNVgkSgkhW8YH7ZyvkiIcKE_oeD_Hqil2BcqMABFddqLYAoPEQj49TJ_q7pMpzWSP-EVr2GWpI1kmAhJOGILngaZVyGxqQjwZ-ZoOI0z0mJCfXwlyMjB28ReNlNurs-8EToiXecBFaJGtKdUbF4KCBm4bpE5gucx16B8aD2Bl3eu5--byB1E&src-supplier=Compliance+Statements; Supplier 1: DigiKey; Supplier Part Number 1: 505-ADL5308ACCZ-ND; Manufacturer_Name: Analog Devices; Manufacturer_Part_Number: ADL5308ACCZ; Datasheet Link: https://www.analog.com/media/en/technical-documentation/data-sheets/adl5308.pdf; Value: ADL5308ACCZ

## Sheet [6] AnalogChannels_5_6_7_8.SchDoc: =DocumentName
size A3; Organization: ORGANIZATION; Address1: R. Aprígio Veloso, 882, Universitário; Address2: Campina Grande - PB; Address3: 58429-900; DocumentNumber: 6; Revision: -; SheetNumber: 6; SheetTotal: 8; Project: PCB_Project_MOPA_D.PrjPcb; ENG_DATE: --/--/--; DSN_DATE: --/--/--; CHK_DATE: --/--/--; SCH_SCALE: 1:1
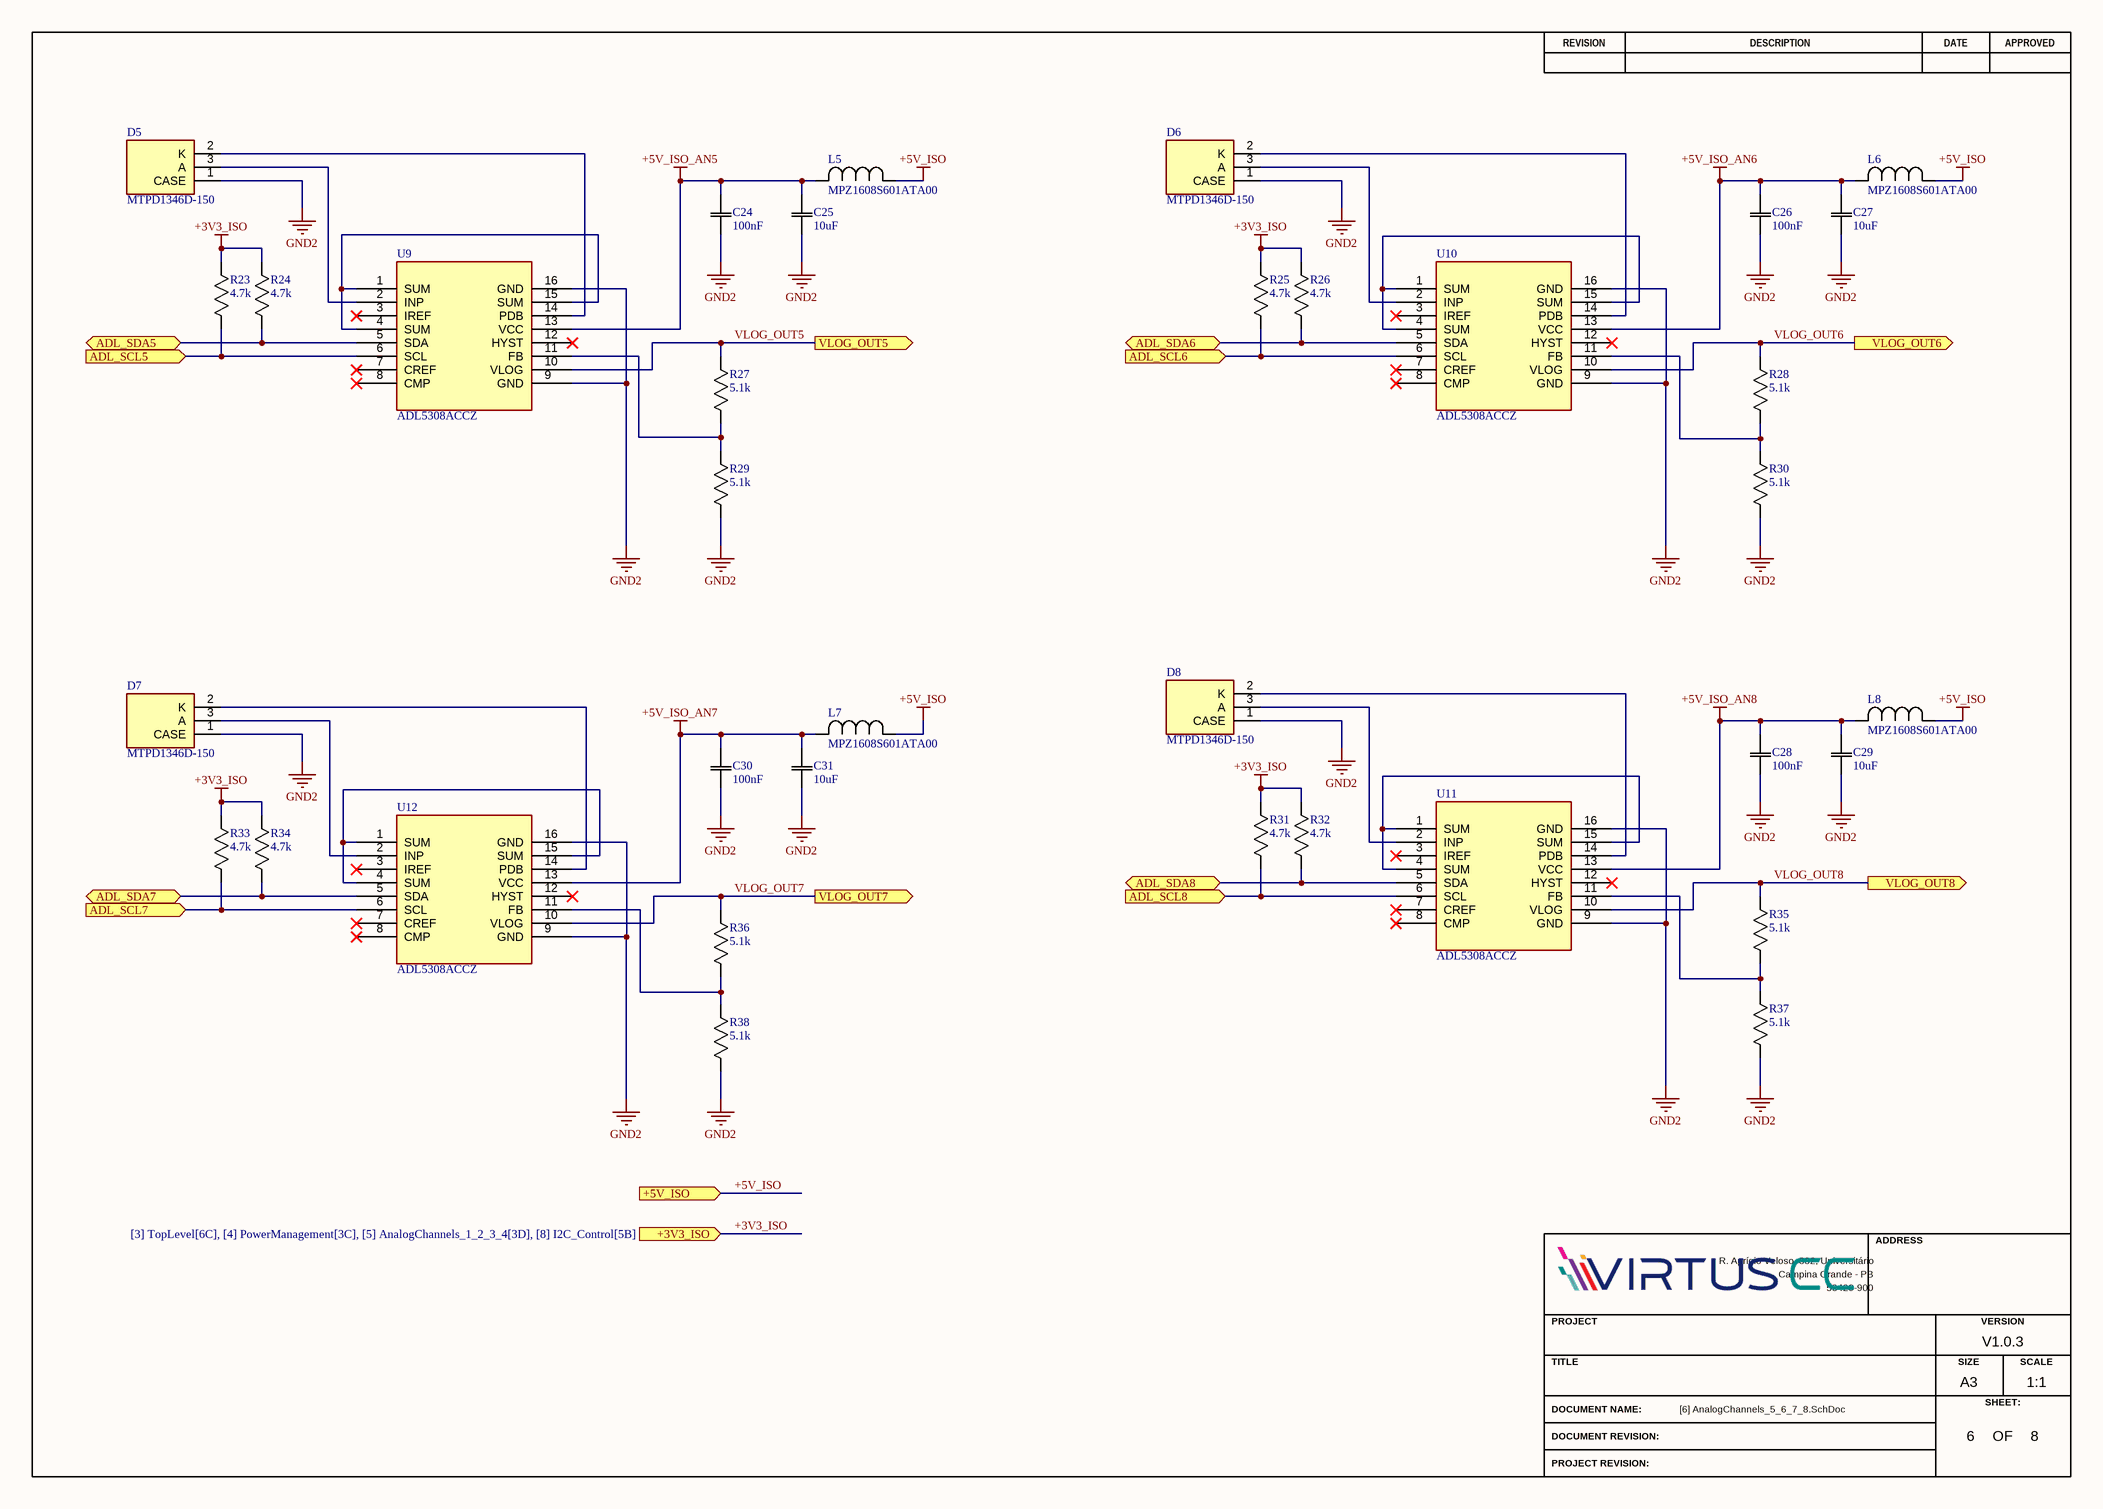
[diagram p4: [6] AnalogChannels_5_6_7_8.SchDoc]

### Parts
C24  value 100nF  [CAPC1005X40N]  (hidden comment: GCM155R71H104KE02D)
C25  value 10uF  [CAPC1005X40N]  (hidden comment: GRT155R61A106ME13D)
C26  value 100nF  [CAPC1005X40N]  (hidden comment: GCM155R71H104KE02D)
C27  value 10uF  [CAPC1005X40N]  (hidden comment: GRT155R61A106ME13D)
C28  value 100nF  [CAPC1005X40N]  (hidden comment: GCM155R71H104KE02D)
C29  value 10uF  [CAPC1005X40N]  (hidden comment: GRT155R61A106ME13D)
C30  value 100nF  [CAPC1005X40N]  (hidden comment: GCM155R71H104KE02D)
C31  value 10uF  [CAPC1005X40N]  (hidden comment: GRT155R61A106ME13D)
D5  MTPD1346D-150  [TO127P540X1680-3N]
D6  MTPD1346D-150  [TO127P540X1680-3N]
D7  MTPD1346D-150  [TO127P540X1680-3N]
D8  MTPD1346D-150  [TO127P540X1680-3N]
L5  MPZ1608S601ATA00  [INDC1608X06N]
L6  MPZ1608S601ATA00  [INDC1608X06N]
L7  MPZ1608S601ATA00  [INDC1608X06N]
L8  MPZ1608S601ATA00  [INDC1608X06N]
R23  value 4.7k  [RESC1005X40N]  (hidden comment: RC0402FR-074K7L)
R24  value 4.7k  [RESC1005X40N]  (hidden comment: RC0402FR-074K7L)
R25  value 4.7k  [RESC1005X40N]  (hidden comment: RC0402FR-074K7L)
R26  value 4.7k  [RESC1005X40N]  (hidden comment: RC0402FR-074K7L)
R27  value 5.1k  [RESC1005X40N]  (hidden comment: RC0402FR-075K1L)
R28  value 5.1k  [RESC1005X40N]  (hidden comment: RC0402FR-075K1L)
R29  value 5.1k  [RESC1005X40N]  (hidden comment: RC0402FR-075K1L)
R30  value 5.1k  [RESC1005X40N]  (hidden comment: RC0402FR-075K1L)
R31  value 4.7k  [RESC1005X40N]  (hidden comment: RC0402FR-074K7L)
R32  value 4.7k  [RESC1005X40N]  (hidden comment: RC0402FR-074K7L)
R33  value 4.7k  [RESC1005X40N]  (hidden comment: RC0402FR-074K7L)
R34  value 4.7k  [RESC1005X40N]  (hidden comment: RC0402FR-074K7L)
R35  value 5.1k  [RESC1005X40N]  (hidden comment: RC0402FR-075K1L)
R36  value 5.1k  [RESC1005X40N]  (hidden comment: RC0402FR-075K1L)
R37  value 5.1k  [RESC1005X40N]  (hidden comment: RC0402FR-075K1L)
R38  value 5.1k  [RESC1005X40N]  (hidden comment: RC0402FR-075K1L)
U9  ADL5308ACCZ  [CC-14-4_ADI]
U10  ADL5308ACCZ  [CC-14-4_ADI]
U11  ADL5308ACCZ  [CC-14-4_ADI]
U12  ADL5308ACCZ  [CC-14-4_ADI]

### Ports
+3V3_ISO (in, see [3] TopLevel[6C], [4] PowerManagement[3C], [5] AnalogChannels_1_2_3_4[3D], [8] I2C_Control[5B]), +5V_ISO (in, see [3] TopLevel[6C], [4] PowerManagement[4B], [5] AnalogChannels_1_2_3_4[3D]), ADL_SCL5 (in, see [3] TopLevel[6C], [8] I2C_Control[5B]), ADL_SCL6 (in, see [3] TopLevel[6C], [8] I2C_Control[5B]), ADL_SCL7 (in, see [3] TopLevel[6C], [8] I2C_Control[5B]), ADL_SCL8 (in, see [3] TopLevel[6C], [8] I2C_Control[5A]), ADL_SDA5 (bidir, see [3] TopLevel[6C], [8] I2C_Control[5B]), ADL_SDA6 (bidir, see [3] TopLevel[6C], [8] I2C_Control[5B]), ADL_SDA7 (bidir, see [3] TopLevel[6C], [8] I2C_Control[5B]), ADL_SDA8 (bidir, see [3] TopLevel[6C], [8] I2C_Control[5B]), VLOG_OUT5 (out, see [3] TopLevel[7C], [7] ADC_Acquisition[3A]), VLOG_OUT6 (out, see [3] TopLevel[7C], [7] ADC_Acquisition[3A]), VLOG_OUT7 (out, see [3] TopLevel[7C], [7] ADC_Acquisition[3A]), VLOG_OUT8 (out, see [3] TopLevel[7C], [7] ADC_Acquisition[3B])

### Nets
+3V3_ISO: R23.1 R24.1 R25.1 R26.1 R31.1 R32.1 R33.1 R34.1 ; port +3V3_ISO
+5V_ISO: L5.1 L6.1 L7.1 L8.1 ; port +5V_ISO
+5V_ISO_AN5: C24.2 C25.2 L5.2 U9.13(VCC)
+5V_ISO_AN6: C26.2 C27.2 L6.2 U10.13(VCC)
+5V_ISO_AN7: C30.2 C31.2 L7.2 U12.13(VCC)
+5V_ISO_AN8: C28.2 C29.2 L8.2 U11.13(VCC)
GND2: C24.1 C25.1 C26.1 C27.1 C28.1 C29.1 C30.1 C31.1 D5.1(CASE) D6.1(CASE) D7.1(CASE) D8.1(CASE) R29.2 R30.2 R37.2 R38.2 U9.9(GND) U9.16(GND) U10.9(GND) U10.16(GND) U11.9(GND) U11.16(GND) U12.9(GND) U12.16(GND)
VLOG_OUT5: R27.1 U9.10(VLOG) ; port VLOG_OUT5
VLOG_OUT6: R28.1 U10.10(VLOG) ; port VLOG_OUT6
VLOG_OUT7: R36.1 U12.10(VLOG) ; port VLOG_OUT7
VLOG_OUT8: R35.1 U11.10(VLOG) ; port VLOG_OUT8
NetD5_2: D5.2(K) U9.14(PDB)
NetD5_3: D5.3(A) U9.2(INP)
NetD6_2: D6.2(K) U10.14(PDB)
NetD6_3: D6.3(A) U10.2(INP)
NetD7_2: D7.2(K) U12.14(PDB)
NetD7_3: D7.3(A) U12.2(INP)
NetD8_2: D8.2(K) U11.14(PDB)
NetD8_3: D8.3(A) U11.2(INP)
NetR23_2: R23.2 U9.6(SCL) ; port ADL_SCL5
NetR24_2: R24.2 U9.5(SDA) ; port ADL_SDA5
NetR25_2: R25.2 U10.6(SCL) ; port ADL_SCL6
NetR26_2: R26.2 U10.5(SDA) ; port ADL_SDA6
NetR27_2: R27.2 R29.1 U9.11(FB)
NetR28_2: R28.2 R30.1 U10.11(FB)
NetR31_2: R31.2 U11.6(SCL) ; port ADL_SCL8
NetR32_2: R32.2 U11.5(SDA) ; port ADL_SDA8
NetR33_2: R33.2 U12.6(SCL) ; port ADL_SCL7
NetR34_2: R34.2 U12.5(SDA) ; port ADL_SDA7
NetR35_2: R35.2 R37.1 U11.11(FB)
NetR36_2: R36.2 R38.1 U12.11(FB)
NetU9_1: U9.1(SUM) U9.4(SUM) U9.15(SUM)
NetU10_1: U10.1(SUM) U10.4(SUM) U10.15(SUM)
NetU11_1: U11.1(SUM) U11.4(SUM) U11.15(SUM)
NetU12_1: U12.1(SUM) U12.4(SUM) U12.15(SUM)

Not connected (* = marked no-connect by the designer): U9 3(IREF)* 7(CREF)* 8(CMP)* 12(HYST)*; U10 3(IREF)* 7(CREF)* 8(CMP)* 12(HYST)*; U11 3(IREF)* 7(CREF)* 8(CMP)* 12(HYST)*; U12 3(IREF)* 7(CREF)* 8(CMP)* 12(HYST)*

### Notes on the sheet
- REVISION
- DESCRIPTION
- DATE
- APPROVED
- ADDRESS
- PROJECT
- VERSION
- TITLE
- A3
- SIZE
- SCALE
- DOCUMENT NAME:
- DOCUMENT REVISION:
- OF
- SHEET:
- PROJECT REVISION:

### Library data of the parts
C24 C26 C28 C30 = GCM155R71H104KE02D: as C16 on sheet [5] AnalogChannels_1_2_3_4; Copyright: Copyright (C) 2026 Ultra Librarian. All rights reserved.; Manufacturer_Part_Number: GCM155R71H104KE02D; Supplier 1: DigiKey; Supplier Part Number 1: 490-10672-1-ND; Datasheet Link: https://search.murata.co.jp/Ceramy/image/img/A01X/G101/ENG/GCM155R71H104KE02-01.pdf
C25 C27 C29 C31 = GRT155R61A106ME13D: as C17 on sheet [5] AnalogChannels_1_2_3_4; Copyright: Copyright (C) 2026 Ultra Librarian. All rights reserved.; Manufacturer_Part_Number: GRT155R61A106ME13D; Supplier 1: DigiKey; Supplier Part Number 1: 490-GRT155R61A106ME13DCT-ND; Datasheet Link: https://search.murata.co.jp/Ceramy/image/img/A01X/G101/ENG/GRT155R61A106ME13-01A.pdf
D5-D8 = MTPD1346D-150: as D1 on sheet [5] AnalogChannels_1_2_3_4; SnapEDA_Link: https://www.snapeda.com/parts/MTPD1346D-150/Marktech%20Optoelectronics/view-part/2762424/?ref=snap; Value: MTPD1346D-150; Package: TO-46-3 Marktech Optoelectronics; Supplier 1: Digikey; Supplier Part Number 1: 1125-1327-ND; Manufacturer_Part_Number: MTPD1346D-150; Datasheet Link: https://specs.marktechopto.com/pdf/products/datasheet/MTPD1346D-150.pdf
L5-L8 = MPZ1608S601ATA00: as L1 on sheet [5] AnalogChannels_1_2_3_4; Copyright: Copyright (C) 2026 Ultra Librarian. All rights reserved.; Manufacturer_Part_Number: MPZ1608S601ATA00; Supplier 1: DigiKey; Supplier Part Number 1: 445-MPZ1608S601ATA00CT-ND; Supplier 2: Mouser; Supplier Part Number 2: 810-MPZ1608S601ATA00; Value: MPZ1608S601ATA00; Datasheet Link: https://product.tdk.com/en/system/files/dam/doc/product/emc/emc/beads/catalog/beads_commercial_power_mpz1608_en.pdf
R23-R26 R31-R34 = RC0402FR-074K7L: as R7 on sheet [5] AnalogChannels_1_2_3_4; Copyright: Copyright (C) 2025 Ultra Librarian. All rights reserved.; Manufacturer_Part_Number: RC0402FR-074K7L; Supplier: Digikey; Supplier 1: DigiKey; Supplier Part Number 1: 311-4.7KLRCT-ND; Datasheet Link: https://yageogroup.com/content/datasheet/asset/file/PYU-RC_GROUP_51_ROHS_L
R27-R30 R35-R38 = RC0402FR-075K1L: as R11 on sheet [5] AnalogChannels_1_2_3_4; Copyright: Copyright (C) 2025 Ultra Librarian. All rights reserved.; Manufacturer_Part_Number: RC0402FR-075K1L; Supplier: Digikey; Supplier 1: DigiKey; Supplier Part Number 1: 311-5.10KLRDKR-ND; Datasheet Link: https://yageogroup.com/content/datasheet/asset/file/PYU-RC_GROUP_51_ROHS_L
U9-U12 = ADL5308ACCZ: as U5 on sheet [5] AnalogChannels_1_2_3_4; Supplier: DigiKey; Supplier Part Number: 505-ADL5308ACCZ-ND; Category: Integrated Circuits (ICs); ComponentLink1URL: https://octopart.com:443/opatz8j6/c1?t=RA9GQZinOd29-lgehR1mMjPVps_pwNRaRgVV1YHzAIV5tl_XZCUSSAHitgBUBAYOkyHWZwhmuKnJMJd5RxR1VqE6m3xnviegrgL6shNBcrpF4LfPbYQ25RAGHFA1T9s0JOT-tl-QhPVPfLuNoqTz_6GGuiJfIxRC0S7r0DYLo04TjJESfYEQgeF8hwJXvZVADboypZr_g-Ea1XOnqBF-rgke93XuIMELyUETblR1X_UOadx82_PQ_RlLZBBqxzR00efRp-5niCJZslCBmJMmtGL_WYk9XjRWZNLGIjLbjTB1vQWuYu6Ttro&src-supplier=Analog+Devices; ComponentLink1Description: https://octopart.com:443/opatz8j6/c1?t=RA9GQZinOd29-lgehR1mMjPVps_pwNRaRgVV1YHzAIV5tl_XZCUSSAHitgBUBAYOkyHWZwhmuKnJMJd5RxR1VqE6m3xnviegrgL6shNBcrpF4LfPbYQ25RAGHFA1T9s0JOT-tl-QhPVPfLuNoqTz_6GGuiJfIxRC0S7r0DYLo04TjJESfYEQgeF8hwJXvZVADboypZr_g-Ea1XOnqBF-rgke93XuIMELyUETblR1X_UOadx82_PQ_RlLZBBqxzR00efRp-5niCJZslCBmJMmtGL_WYk9XjRWZNLGIjLbjTB1vQWuYu6Ttro&src-supplier=Analog+Devices; ComponentLink2URL: http://sigma.octopart.com:80/conflict_mineral_statement/Analog-Devices-company-33.pdf?src-supplier=Compliance+Statements; ComponentLink2Description: http://sigma.octopart.com:80/conflict_mineral_statement/Analog-Devices-company-33.pdf?src-supplier=Compliance+Statements; ComponentLink3URL: https://octopart.com:443/opatz8j6/c1?t=vRyEE9f1knuZsXfZ1EXV0igJkx_-mJPvDe2PRj94G0bMKfSINrZLJy9UxvHag1Ev7-JZTv2yES3irMYFchBWTpWzSwFH9zvLS0b9JOrPs9Pp2SMp_5VkKg4D-b9XM9N4Wk1jNVgkSgkhW8YH7ZyvkiIcKE_oeD_Hqil2BcqMABFddqLYAoPEQj49TJ_q7pMpzWSP-EVr2GWpI1kmAhJOGILngaZVyGxqQjwZ-ZoOI0z0mJCfXwlyMjB28ReNlNurs-8EToiXecBFaJGtKdUbF4KCBm4bpE5gucx16B8aD2Bl3eu5--byB1E&src-supplier=Compliance+Statements; ComponentLink3Description: https://octopart.com:443/opatz8j6/c1?t=vRyEE9f1knuZsXfZ1EXV0igJkx_-mJPvDe2PRj94G0bMKfSINrZLJy9UxvHag1Ev7-JZTv2yES3irMYFchBWTpWzSwFH9zvLS0b9JOrPs9Pp2SMp_5VkKg4D-b9XM9N4Wk1jNVgkSgkhW8YH7ZyvkiIcKE_oeD_Hqil2BcqMABFddqLYAoPEQj49TJ_q7pMpzWSP-EVr2GWpI1kmAhJOGILngaZVyGxqQjwZ-ZoOI0z0mJCfXwlyMjB28ReNlNurs-8EToiXecBFaJGtKdUbF4KCBm4bpE5gucx16B8aD2Bl3eu5--byB1E&src-supplier=Compliance+Statements; Supplier 1: DigiKey; Supplier Part Number 1: 505-ADL5308ACCZ-ND; Manufacturer_Name: Analog Devices; Manufacturer_Part_Number: ADL5308ACCZ; Datasheet Link: https://www.analog.com/media/en/technical-documentation/data-sheets/adl5308.pdf; Value: ADL5308ACCZ

## Sheet [4] PowerManagement.SchDoc: =DocumentName
size A3; Organization: ORGANIZATION; Address1: R. Aprígio Veloso, 882, Universitário; Address2: Campina Grande - PB; Address3: 58429-900; DocumentNumber: 4; Revision: -; SheetNumber: 4; SheetTotal: 8; Project: PCB_Project_MOPA_D.PrjPcb; ENG_DATE: --/--/--; DSN_DATE: --/--/--; CHK_DATE: --/--/--; SCH_SCALE: 1:1
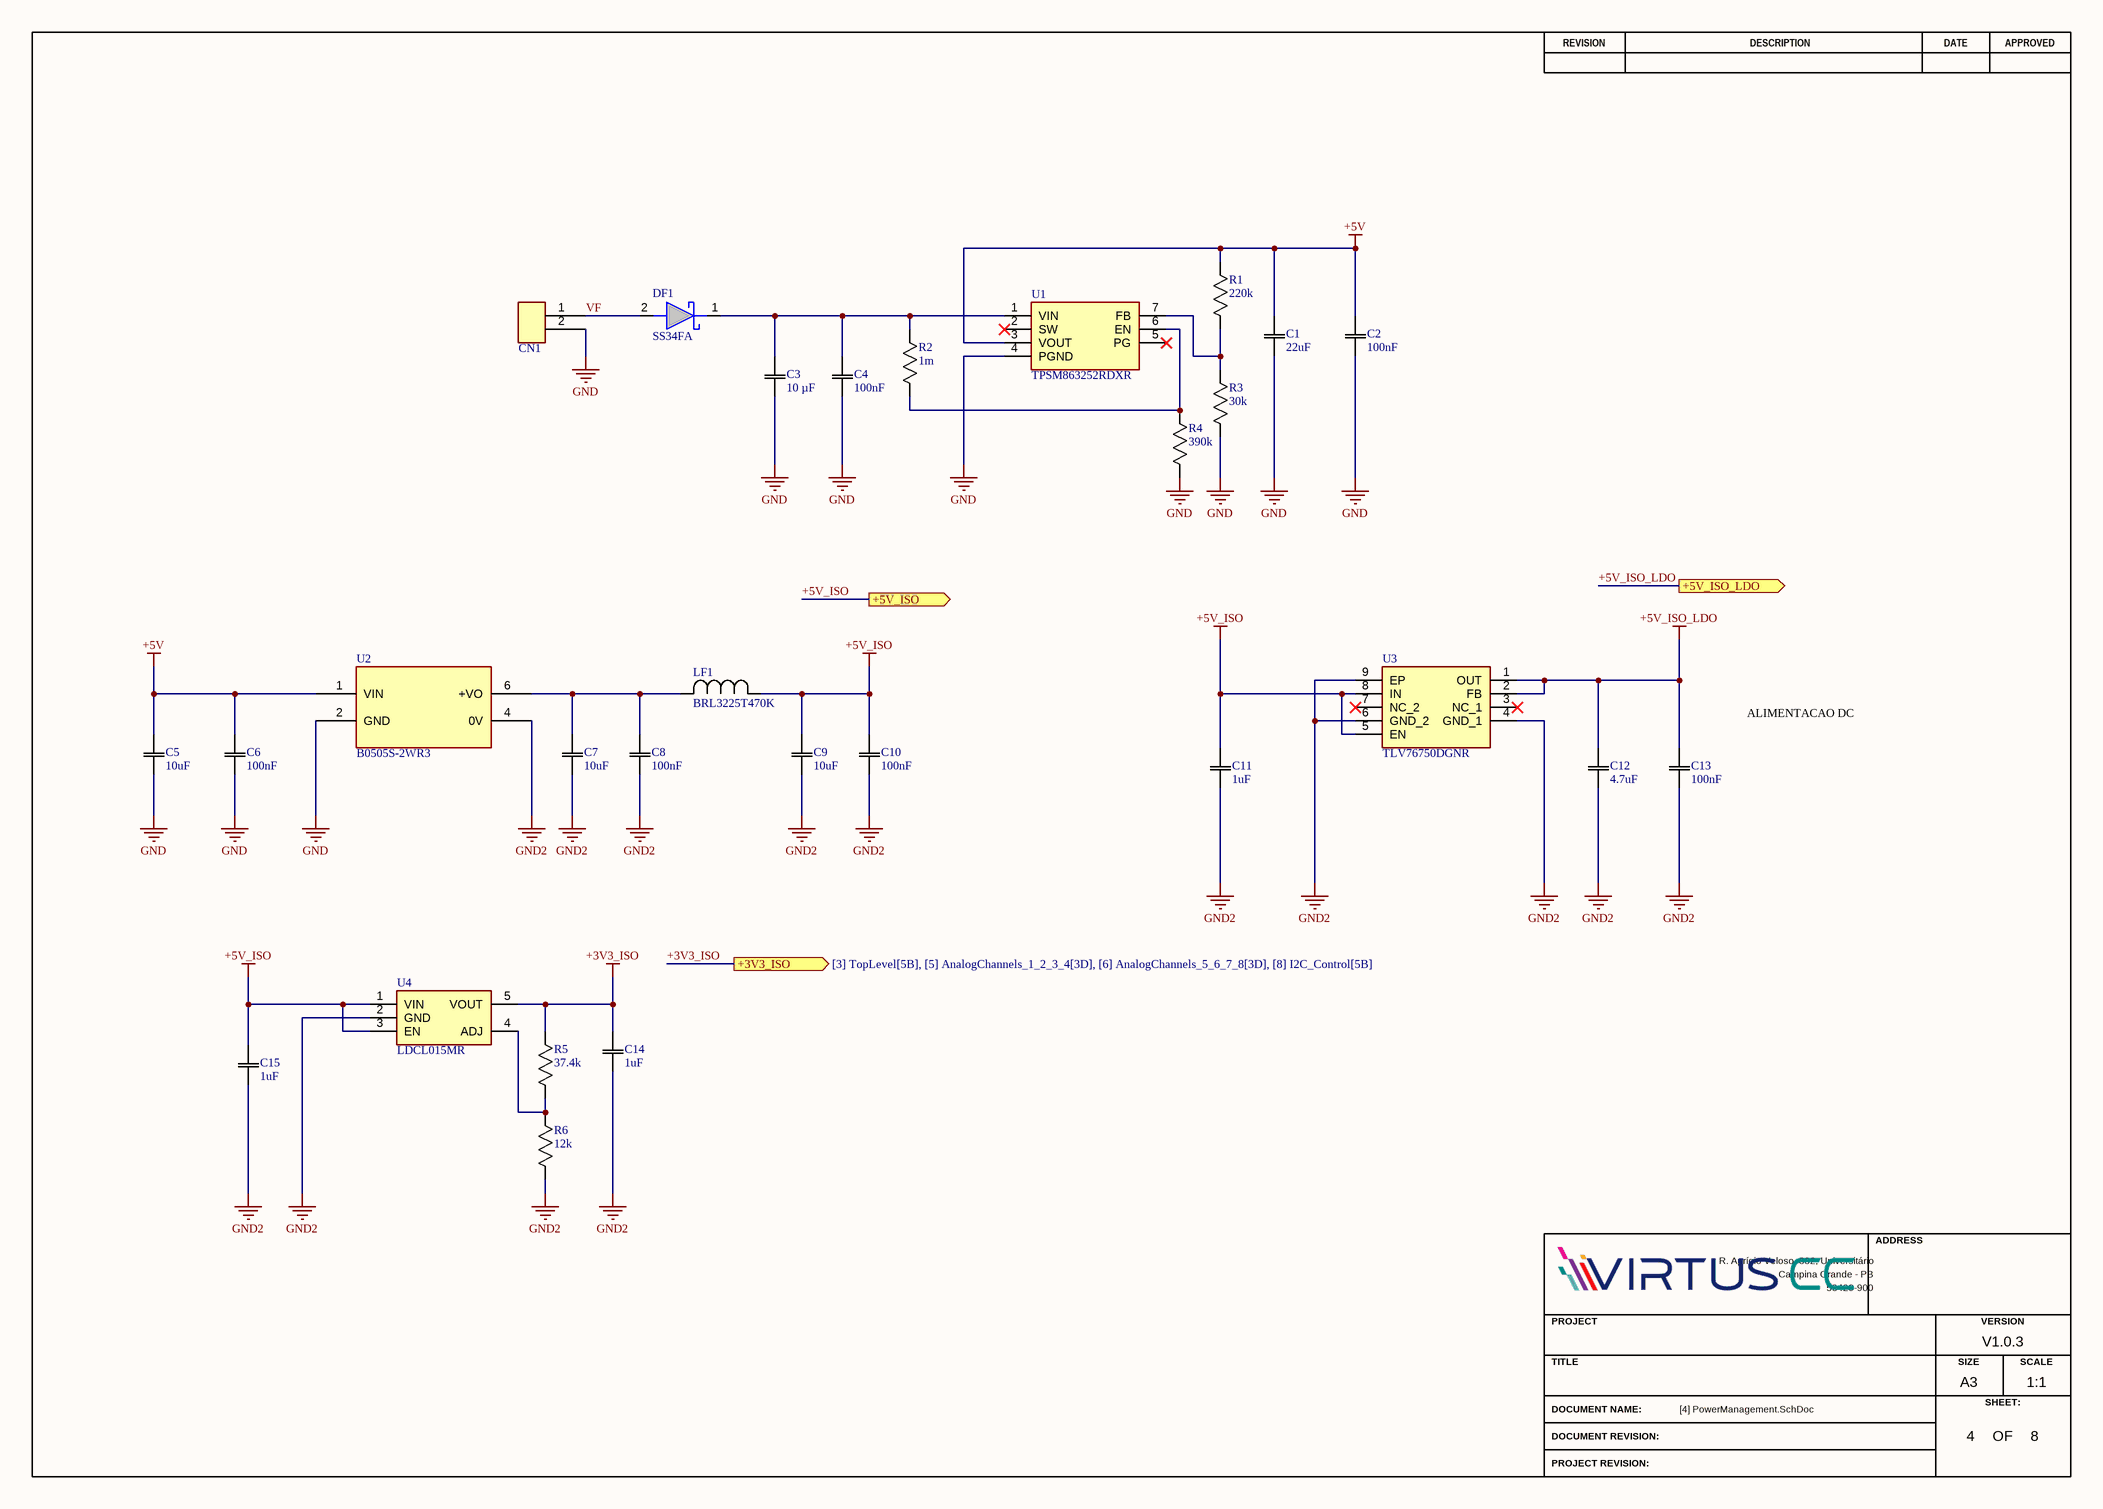
[diagram p5: [4] PowerManagement.SchDoc]

### Parts
C1  value 22uF  [CAPC1608X06N]  (hidden comment: CL10A226MO7JZNC)
C2  value 100nF  [CAPC1005X40N]  (hidden comment: GCM155R71H104KE02D)
C3  value 10 µF  [CAPC1608X06N]  (hidden comment: CL10A106MA8NRNC)
C4  value 100nF  [CAPC1005X40N]  (hidden comment: GCM155R71H104KE02D)
C5  value 10uF  [CAPC1005X40N]  (hidden comment: GRT155R61A106ME13D)
C6  value 100nF  [CAPC1005X40N]  (hidden comment: GCM155R71H104KE02D)
C7  value 10uF  [CAPC1005X40N]  (hidden comment: GRT155R61A106ME13D)
C8  value 100nF  [CAPC1005X40N]  (hidden comment: GCM155R71H104KE02D)
C9  value 10uF  [CAPC1005X40N]  (hidden comment: GRT155R61A106ME13D)
C10  value 100nF  [CAPC1005X40N]  (hidden comment: GCM155R71H104KE02D)
C11  value 1uF  [CAPC1005X40N]  (hidden comment: GRM155Z71A105KE01D)
C12  value 4.7uF  [CAPC1005X40N]  (hidden comment: GRM155R61A475MEAAD)
C13  value 100nF  [CAPC1005X40N]  (hidden comment: GCM155R71H104KE02D)
C14  value 1uF  [CAPC1005X40N]  (hidden comment: GRM155Z71A105KE01D)
C15  value 1uF  [CAPC1005X40N]  (hidden comment: GRM155Z71A105KE01D)
CN1  JDCN2.0  [JACK - P4]  (value not drawn)
DF1  SS34FA  [SODFL3618X143N]
LF1  BRL3225T470K  [IND_TAIYO_BRL3225_TAY]
R1  value 220k  [RESC1005X40N]  (hidden comment: RC0402FR-07220KL)
R2  value 1m  [RESC1005X40N]  (hidden comment: RC0402FR-071ML)
R3  value 30k  [RESC1005X40N]  (hidden comment: RC0402FR-0730KL)
R4  value 390k  [RESC1005X40N]  (hidden comment: RC0402FR-07390KL)
R5  value 37.4k  [RESC1005X40N]  (hidden comment: RC0402FR-0737K4L)
R6  value 12k  [RESC1005X40N]  (hidden comment: RC0402FR-0712KL)
U1  TPSM863252RDXR  [RDX0007A-MFG - 2]
U2  B0505S-2WR3  [B_S-2WR2_MNS]
U3  TLV76750DGNR  [VSSOP_0DGNR_TEX]
U4  LDCL015MR  [SOT95P280X145-5N]

### Ports
+3V3_ISO (out, see [3] TopLevel[5B], [5] AnalogChannels_1_2_3_4[3D], [6] AnalogChannels_5_6_7_8[3D], [8] I2C_Control[5B]), +5V_ISO (out, see [3] TopLevel[5B], [5] AnalogChannels_1_2_3_4[3D], [6] AnalogChannels_5_6_7_8[3D]), +5V_ISO_LDO (out, see [3] TopLevel[5B], [7] ADC_Acquisition[3B])

### Nets
+3V3_ISO: C14.2 R5.1 U4.5(VOUT) ; port +3V3_ISO
+5V: C1.2 C2.2 C5.2 C6.2 R1.1 U1.3(VOUT) U2.1(VIN)
+5V_ISO: C9.2 C10.2 C11.2 C15.2 LF1.1 U3.5(EN) U3.8(IN) U4.1(VIN) U4.3(EN) ; port +5V_ISO
+5V_ISO_LDO: C12.2 C13.2 U3.1(OUT) U3.2(FB) ; port +5V_ISO_LDO
GND: C1.1 C2.1 C3.1 C4.1 C5.1 C6.1 CN1.2 R3.2 R4.2 U1.4(PGND) U2.2(GND)
GND2: C7.1 C8.1 C9.1 C10.1 C11.1 C12.1 C13.1 C14.1 C15.1 R6.2 U2.4(0V) U3.4(GND_1) U3.6(GND_2) U3.9(EP) U4.2(GND)
VF: CN1.1 DF1.2(A)
NetC3_2: C3.2 C4.2 DF1.1(K) R2.1 U1.1(VIN)
NetC7_2: C7.2 C8.2 LF1.2 U2.6(+VO)
NetR1_2: R1.2 R3.1 U1.7(FB)
NetR2_2: R2.2 R4.1 U1.6(EN)
NetR5_2: R5.2 R6.1 U4.4(ADJ)

Not connected (* = marked no-connect by the designer): U1 2(SW)* 5(PG)*; U3 3(NC_1)* 7(NC_2)*

### Notes on the sheet
- ALIMENTACAO DC
- REVISION
- DESCRIPTION
- DATE
- APPROVED
- ADDRESS
- PROJECT
- VERSION
- TITLE
- A3
- SIZE
- SCALE
- DOCUMENT NAME:
- DOCUMENT REVISION:
- OF
- SHEET:
- PROJECT REVISION:

### Library data of the parts
C1 = CL10A226MO7JZNC: 22 µF ±20% 16V Ceramic Capacitor X5R 0603 (1608 Metric); Manufacturer_Name: Samsung; Copyright: Copyright (C) 2026 Ultra Librarian. All rights reserved.; Manufacturer_Part_Number: CL10A226MO7JZNC; Supplier 1: DigiKey; Supplier Part Number 1: 1276-7076-1-ND; Datasheet Link: https://mm.digikey.com/Volume0/opasdata/d220001/medias/docus/2139/CL10A226MO7JZNC_Spec.pdf
C2 C4 C6 C8 C10 C13 = GCM155R71H104KE02D: as C16 on sheet [5] AnalogChannels_1_2_3_4; Copyright: Copyright (C) 2026 Ultra Librarian. All rights reserved.; Manufacturer_Part_Number: GCM155R71H104KE02D; Supplier 1: DigiKey; Supplier Part Number 1: 490-10672-1-ND; Datasheet Link: https://search.murata.co.jp/Ceramy/image/img/A01X/G101/ENG/GCM155R71H104KE02-01.pdf
C3 = CL10A106MA8NRNC: 10 µF ±20% 25V Ceramic Capacitor X5R 0603 (1608 Metric); Manufacturer_Name: Samsung; Copyright: Copyright (C) 2025 Ultra Librarian. All rights reserved.; Manufacturer_Part_Number: CL10A106MA8NRNC; Supplier 1: DigiKey; Supplier Part Number 1: 1276-1869-1-ND; Datasheet Link: https://mm.digikey.com/Volume0/opasdata/d220001/medias/docus/658/CL10A106MA8NRNC_Spec.pdf
C5 C7 C9 = GRT155R61A106ME13D: as C17 on sheet [5] AnalogChannels_1_2_3_4; Copyright: Copyright (C) 2026 Ultra Librarian. All rights reserved.; Manufacturer_Part_Number: GRT155R61A106ME13D; Supplier 1: DigiKey; Supplier Part Number 1: 490-GRT155R61A106ME13DCT-ND; Datasheet Link: https://search.murata.co.jp/Ceramy/image/img/A01X/G101/ENG/GRT155R61A106ME13-01A.pdf
C11 C14 C15 = GRM155Z71A105KE01D: 1 µF ±10% 10V Ceramic Capacitor X7R 0402 (1005 Metric); Manufacturer_Name: Murata; Copyright: Copyright (C) 2025 Ultra Librarian. All rights reserved.; Manufacturer_Part_Number: GRM155Z71A105KE01D; Supplier 1: DigiKey; Supplier Part Number 1: 490-GRM155Z71A105KE01DCT-ND
C12 = GRM155R61A475MEAAD: 4.7 µF ±20% 10V Ceramic Capacitor X5R 0402 (1005 Metric); Manufacturer_Name: Murata; Copyright: Copyright (C) 2025 Ultra Librarian. All rights reserved.; Manufacturer_Part_Number: GRM155R61A475MEAAD; Supplier 1: DigiKey; Supplier Part Number 1: 490-14306-1-ND
CN1 = JDCN2.0: Conector Fonte. JDCN2.0; Manufacturer: *; Datasheet 1: *; Supplier Link 1: *; Package: *; Price 1: *; Value: *; Supplier 1: *; Manufacturer Part Number: *; Supplier Part Number 1: *; Supplier 2: DigiKey; Supplier Part Number 2: CP-037A-ND; Supplier Link 2: *; Price 2: *; Datasheet 2: *
DF1 = SS34FA: UL Flammability 94V-0 Classification; MSL 1 per J-STD-020; Low Power Loss, High Efficiency; Guard Ring for Overvoltage Protection; RoHS Compliant / Green Molding Compound; High Surge Current Capability; NRVB Prefix for Automotive and Other Applications Requiring Unique Site and Control Change Requirements; AECQ101 Qualified and PPAP Capable; Manufacturer_Name: onsemi; Geometry.Height: 1.43mm; Manufacturer_Part_Number: SS34FA; Mouser Part Number: 512-SS34FA; Mouser Price/Stock: https://www.mouser.co.uk/ProductDetail/onsemi-Fairchild/SS34FA?qs=R26iFe%2FkX%2FK1QUwZdCmBBw%3D%3D; Arrow Part Number: SS34FA; Arrow Price/Stock: https://www.arrow.com/en/products/ss34fa/on-semiconductor?utm_currency=USD&region=nac; Datasheet Link: https://www.onsemi.com/pub/Collateral/SS36FA-D.PDF
LF1 = BRL3225T470K: 47 µH Semi-Shielded Drum Core, Wirewound Inductor 390 mA 1.2Ohm Max 1210 (3225 Metric); Manufacturer_Name: TAIYO YUDEN; Value: 47uF; Copyright: Copyright (C) 2025 Ultra Librarian. All rights reserved.; Manufacturer_Part_Number: BRL3225T470K; Supplier 1: DigiKey; Supplier Part Number 1: 587-2169-1-ND; Datasheet Link: https://mm.digikey.com/Volume0/opasdata/d220001/medias/docus/610/BRL3225T470K_SS.pdf
R1 = RC0402FR-07220KL: 220 kOhms ±1% 0.063W, 1/16W Chip Resistor 0402 (1005 Metric) Moisture Resistant Thick Film; Manufacturer_Name: Yageo; Copyright: Copyright (C) 2026 Ultra Librarian. All rights reserved.; Manufacturer_Part_Number: RC0402FR-07220KL; Supplier 1: DigiKey; Supplier Part Number 1: 311-220KLRCT-ND; Datasheet Link: https://yageogroup.com/content/datasheet/asset/file/PYU-RC_GROUP_51_ROHS_L
R2 = RC0402FR-071ML: 1 MOhms ±1% 0.063W, 1/16W Chip Resistor 0402 (1005 Metric) Moisture Resistant Thick Film; Manufacturer_Name: Yageo; Copyright: Copyright (C) 2026 Ultra Librarian. All rights reserved.; Manufacturer_Part_Number: RC0402FR-071ML; Supplier 1: DigiKey; Supplier Part Number 1: 311-1.00MLRCT-ND; Datasheet Link: https://yageogroup.com/content/datasheet/asset/file/PYU-RC_GROUP_51_ROHS_L
R3 = RC0402FR-0730KL: 30 kOhms ±1% 0.063W, 1/16W Chip Resistor 0402 (1005 Metric) Moisture Resistant Thick Film; Manufacturer_Name: Yageo; Copyright: Copyright (C) 2026 Ultra Librarian. All rights reserved.; Manufacturer_Part_Number: RC0402FR-0730KL; Supplier 1: DigiKey; Supplier Part Number 1: 311-30.0KLRCT-ND; Datasheet Link: https://yageogroup.com/content/datasheet/asset/file/PYU-RC_GROUP_51_ROHS_L
R4 = RC0402FR-07390KL: 390 kOhms ±1% 0.063W, 1/16W Chip Resistor 0402 (1005 Metric) Moisture Resistant Thick Film; Manufacturer_Name: Yageo; Copyright: Copyright (C) 2026 Ultra Librarian. All rights reserved.; Manufacturer_Part_Number: RC0402FR-07390KL; Supplier 1: DigiKey; Supplier Part Number 1: YAG3143CT-ND; Datasheet Link: https://yageogroup.com/content/datasheet/asset/file/PYU-RC_GROUP_51_ROHS_L
R5 = RC0402FR-0737K4L: 37.4 kOhms ±1% 0.063W, 1/16W Chip Resistor 0402 (1005 Metric) Moisture Resistant Thick Film; Manufacturer_Name: Yageo; Copyright: Copyright (C) 2026 Ultra Librarian. All rights reserved.; Manufacturer_Part_Number: RC0402FR-0737K4L; Supplier 1: DigiKey; Supplier Part Number 1: YAG3138CT-ND; Datasheet Link: https://yageogroup.com/content/datasheet/asset/file/PYU-RC_GROUP_51_ROHS_L
R6 = RC0402FR-0712KL: 12 kOhms ±1% 0.063W, 1/16W Chip Resistor 0402 (1005 Metric) Moisture Resistant Thick Film; Manufacturer_Name: Yageo; Copyright: Copyright (C) 2025 Ultra Librarian. All rights reserved.; Manufacturer_Part_Number: RC0402FR-0712KL; Supplier: Digikey; Supplier Part Number 1: 311-12.0KLRCT-ND; Supplier 1: Digikey; Datasheet Link: https://yageogroup.com/content/datasheet/asset/file/PYU-RC_GROUP_51_ROHS_L
U1 = TPSM863252RDXR: 3-V to 17-V input voltage, 3-A Eco-mode synchronous buck module 7-QFN-FCMOD -40 to 125; Manufacturer_Name: Texas Instruments; TYPE: TYPE; RefDes: RefDes; Copyright: Copyright (C) 2025 Ultra Librarian. All rights reserved.; Manufacturer_Part_Number: TPSM863252RDXR; Supplier: Digikey; Supplier 1: DigiKey; Supplier Part Number 1: 296-TPSM863252RDXRCT-ND; Value: TPSM863252RDXR; Parameter 2: *
U2 = B0505S-2WR3: Isolated Module DC DC Converter 1 Output 5V 400mA 4.5V - 5.5V Input; Manufacturer_Name: MORNSUN; Type: DC DC Converters; Copyright: Copyright (C) 2026 Ultra Librarian. All rights reserved.; Manufacturer_Part_Number: B0505S-2WR3; RefDes: RefDes; Supplier 1: Digikey; Supplier Part Number 1: 2725-B0505S-2WR3-ND; Value: B0505S-2WR3; Datasheet Link: https://www.mornsun-power.com/html/pdf/B0505S-2WR3.html
U3 = TLV76750DGNR: LDO Voltage Regulators Adjustable- and fixed-output, 1-A, 16-V, positive-voltage low-dropout (LDO) linear regulator 8-HVSSOP -40 to 125; Manufacturer_Name: Texas Instruments; Geometry.Height: 1.1mm; Manufacturer_Part_Number: TLV76750DGNR; Mouser Part Number: 595-TLV76750DGNR; Mouser Price/Stock: https://www.mouser.co.uk/ProductDetail/Texas-Instruments/TLV76750DGNR?qs=QNEnbhJQKvaJEVkWGWZhnw%3D%3D; Arrow Part Number: *; Arrow Price/Stock: *; Datasheet Link: https://www.ti.com/lit/gpn/tlv767
U4 = LDCL015MR: Linear Voltage Regulator IC Positive Adjustable 1 Output 150mA SOT-23-5; Manufacturer_Name: STMicroelectronics; Parameter 1: 497-12085-1-ND; Datasheet Link: https://www.st.com/resource/en/datasheet/ldcl015.pdf; Height: 1.45mm; Manufacturer_Part_Number: LDCL015MR; Mouser Part Number: 511-LDCL015MR; Mouser Price/Stock: https://www.mouser.co.uk/ProductDetail/STMicroelectronics/LDCL015MR?qs=GkDVaEP5dcuyqQ8OoCXIYg%3D%3D; Arrow Part Number: LDCL015MR; Arrow Price/Stock: https://www.arrow.com/en/products/ldcl015mr/stmicroelectronics?region=nac; Supplier 1: Digikey; Value: LDCL015MR

## Sheet [8] I2C_Control.SchDoc: =DocumentName
size A3; Organization: ORGANIZATION; Address1: R. Aprígio Veloso, 882, Universitário; Address2: Campina Grande - PB; Address3: 58429-900; DocumentNumber: 8; Revision: -; SheetNumber: 8; SheetTotal: 8; Project: PCB_Project_MOPA_D.PrjPcb; ENG_DATE: --/--/--; DSN_DATE: --/--/--; CHK_DATE: --/--/--; SCH_SCALE: 1:1
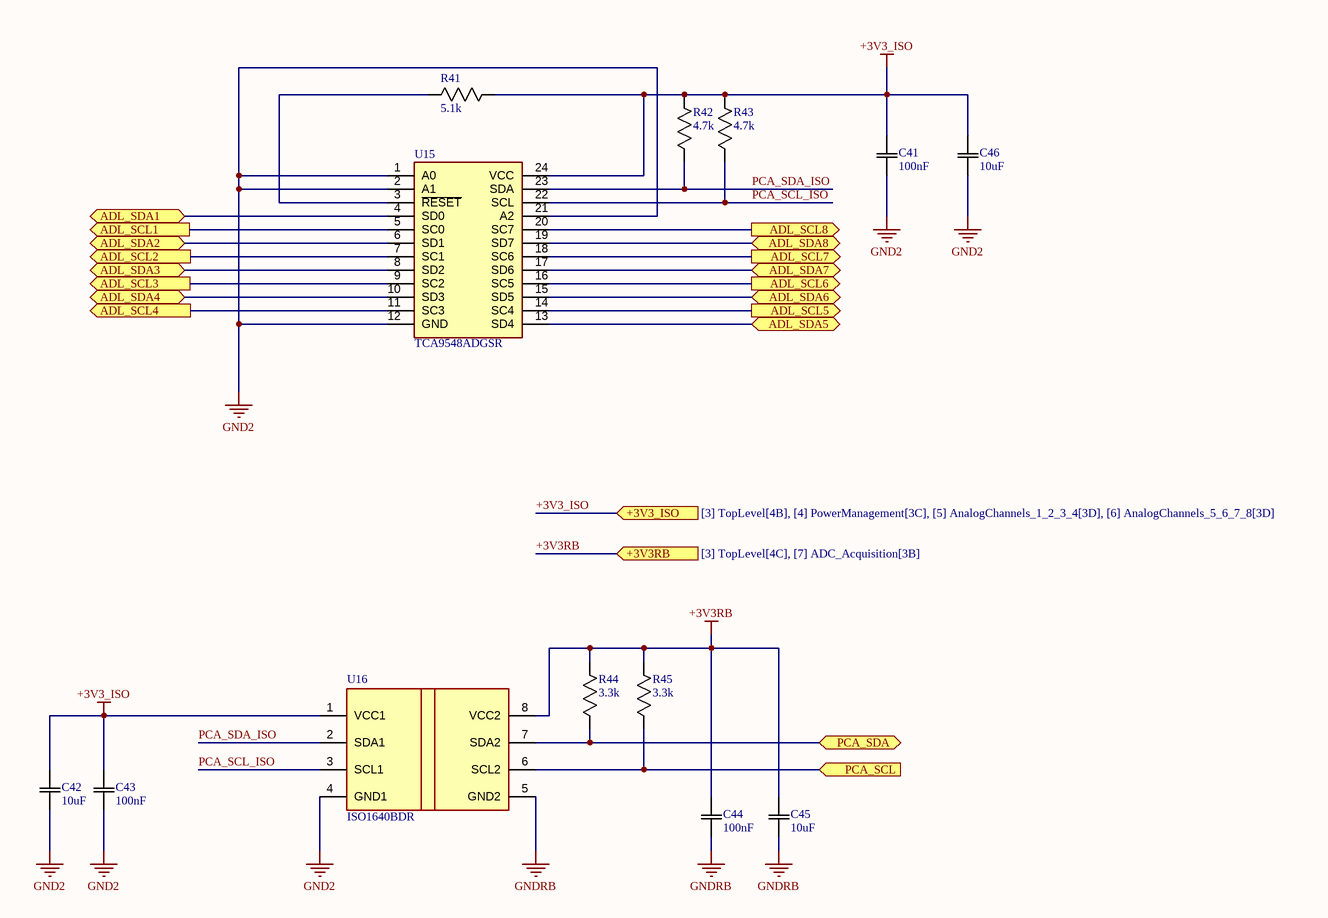
[diagram p6: [8] I2C_Control.SchDoc]

### Parts
C41  value 100nF  [CAPC1005X40N]  (hidden comment: GCM155R71H104KE02D)
C42  value 10uF  [CAPC1005X40N]  (hidden comment: GRM155R61A102KA01D)
C43  value 100nF  [CAPC1005X40N]  (hidden comment: GCM155R71H104KE02D)
C44  value 100nF  [CAPC1005X40N]  (hidden comment: GCM155R71H104KE02D)
C45  value 10uF  [CAPC1005X40N]  (hidden comment: GRM155R61A102KA01D)
C46  value 10uF  [CAPC1005X40N]  (hidden comment: GRM155R61A102KA01D)
R41  value 5.1k  [RESC1005X40N]  (hidden comment: RC0402FR-075K1L)
R42  value 4.7k  [RESC1005X40N]  (hidden comment: RC0402FR-074K7L)
R43  value 4.7k  [RESC1005X40N]  (hidden comment: RC0402FR-074K7L)
R44  value 3.3k  [RESC1005X40N]  (hidden comment: RC0402FR-073K3L)
R45  value 3.3k  [RESC1005X40N]  (hidden comment: RC0402FR-073K3L)
U15  TCA9548ADGSR  [SOP50P490X110-24N]
U16  ISO1640BDR  [SOIC127P600X175-8N]

### Ports
+3V3_ISO (in, see [3] TopLevel[4B], [4] PowerManagement[3C], [5] AnalogChannels_1_2_3_4[3D], [6] AnalogChannels_5_6_7_8[3D]), +3V3RB (in, see [3] TopLevel[4C], [7] ADC_Acquisition[3B]), ADL_SCL1 (out, see [3] TopLevel[5B], [5] AnalogChannels_1_2_3_4[1A]), ADL_SCL2 (out, see [3] TopLevel[5B], [5] AnalogChannels_1_2_3_4[5A]), ADL_SCL3 (out, see [3] TopLevel[5B], [5] AnalogChannels_1_2_3_4[1C]), ADL_SCL4 (out, see [3] TopLevel[5B], [5] AnalogChannels_1_2_3_4[5C]), ADL_SCL5 (out, see [3] TopLevel[5C], [6] AnalogChannels_5_6_7_8[1A]), ADL_SCL6 (out, see [3] TopLevel[5C], [6] AnalogChannels_5_6_7_8[5A]), ADL_SCL7 (out, see [3] TopLevel[5C], [6] AnalogChannels_5_6_7_8[1C]), ADL_SCL8 (out, see [3] TopLevel[5C], [6] AnalogChannels_5_6_7_8[5C]), ADL_SDA1 (bidir, see [3] TopLevel[5B], [5] AnalogChannels_1_2_3_4[1A]), ADL_SDA2 (bidir, see [3] TopLevel[5B], [5] AnalogChannels_1_2_3_4[5A]), ADL_SDA3 (bidir, see [3] TopLevel[5B], [5] AnalogChannels_1_2_3_4[1C]), ADL_SDA4 (bidir, see [3] TopLevel[5B], [5] AnalogChannels_1_2_3_4[5C]), ADL_SDA5 (bidir, see [3] TopLevel[5C], [6] AnalogChannels_5_6_7_8[1A]), ADL_SDA6 (bidir, see [3] TopLevel[5C], [6] AnalogChannels_5_6_7_8[5A]), ADL_SDA7 (bidir, see [3] TopLevel[5C], [6] AnalogChannels_5_6_7_8[1C]), ADL_SDA8 (bidir, see [3] TopLevel[5C], [6] AnalogChannels_5_6_7_8[5C]), PCA_SCL (in, see [3] TopLevel[4C]), PCA_SDA (bidir, see [3] TopLevel[4C])

### Nets
+3V3_ISO: C41.2 C42.2 C43.2 C46.2 R41.1 R42.1 R43.1 U15.24(VCC) U16.1(VCC1) ; port +3V3_ISO
+3V3RB: C44.2 C45.2 R44.1 R45.1 U16.8(VCC2) ; port +3V3RB
GND2: C41.1 C42.1 C43.1 C46.1 U15.1(A0) U15.2(A1) U15.12(GND) U15.21(A2) U16.4(GND1)
GNDRB: C44.1 C45.1 U16.5(GND2)
PCA_SCL: R45.2 U16.6(SCL2) ; port PCA_SCL
PCA_SCL_ISO: R43.2 U15.22(SCL) U16.3(SCL1)
PCA_SDA: R44.2 U16.7(SDA2) ; port PCA_SDA
PCA_SDA_ISO: R42.2 U15.23(SDA) U16.2(SDA1)
NetR7_2: U15.7(SC1) ; port ADL_SCL2
NetR8_2: U15.6(SD1) ; port ADL_SDA2
NetR9_2: U15.5(SC0) ; port ADL_SCL1
NetR10_2: U15.4(SD0) ; port ADL_SDA1
NetR15_2: U15.11(SC3) ; port ADL_SCL4
NetR16_2: U15.10(SD3) ; port ADL_SDA4
NetR17_2: U15.9(SC2) ; port ADL_SCL3
NetR18_2: U15.8(SD2) ; port ADL_SDA3
NetR23_2: U15.14(SC4) ; port ADL_SCL5
NetR24_2: U15.13(SD4) ; port ADL_SDA5
NetR25_2: U15.16(SC5) ; port ADL_SCL6
NetR26_2: U15.15(SD5) ; port ADL_SDA6
NetR31_2: U15.20(SC7) ; port ADL_SCL8
NetR32_2: U15.19(SD7) ; port ADL_SDA8
NetR33_2: U15.18(SC6) ; port ADL_SCL7
NetR34_2: U15.17(SD6) ; port ADL_SDA7
NetR41_2: R41.2 U15.3(~{RESET})

### Notes on the sheet
- REVISION
- DESCRIPTION
- DATE
- APPROVED
- ADDRESS
- PROJECT
- VERSION
- TITLE
- A3
- SIZE
- SCALE
- DOCUMENT NAME:
- DOCUMENT REVISION:
- OF
- SHEET:
- PROJECT REVISION:

### Library data of the parts
C41 C43 C44 = GCM155R71H104KE02D: as C16 on sheet [5] AnalogChannels_1_2_3_4; Copyright: Copyright (C) 2026 Ultra Librarian. All rights reserved.; Manufacturer_Part_Number: GCM155R71H104KE02D; Supplier 1: DigiKey; Supplier Part Number 1: 490-10672-1-ND; Datasheet Link: https://search.murata.co.jp/Ceramy/image/img/A01X/G101/ENG/GCM155R71H104KE02-01.pdf
C42 C45 C46 = GRM155R61A102KA01D: 1000 pF ±10% 10V Ceramic Capacitor X5R 0402 (1005 Metric); Manufacturer_Name: Murata; Copyright: Copyright (C) 2026 Ultra Librarian. All rights reserved.; Manufacturer_Part_Number: GRM155R61A102KA01D; Supplier 1: DigiKey; Supplier Part Number 1: 490-6295-1-ND
R41 = RC0402FR-075K1L: as R11 on sheet [5] AnalogChannels_1_2_3_4; Copyright: Copyright (C) 2025 Ultra Librarian. All rights reserved.; Manufacturer_Part_Number: RC0402FR-075K1L; Supplier: Digikey; Supplier 1: DigiKey; Supplier Part Number 1: 311-5.10KLRDKR-ND; Datasheet Link: https://yageogroup.com/content/datasheet/asset/file/PYU-RC_GROUP_51_ROHS_L
R42 R43 = RC0402FR-074K7L: as R7 on sheet [5] AnalogChannels_1_2_3_4; Copyright: Copyright (C) 2025 Ultra Librarian. All rights reserved.; Manufacturer_Part_Number: RC0402FR-074K7L; Supplier: Digikey; Supplier 1: DigiKey; Supplier Part Number 1: 311-4.7KLRCT-ND; Datasheet Link: https://yageogroup.com/content/datasheet/asset/file/PYU-RC_GROUP_51_ROHS_L
R44 R45 = RC0402FR-073K3L: 3.3 kOhms ±1% 0.063W, 1/16W Chip Resistor 0402 (1005 Metric) Moisture Resistant Thick Film; Manufacturer_Name: Yageo; Copyright: Copyright (C) 2025 Ultra Librarian. All rights reserved.; Manufacturer_Part_Number: RC0402FR-073K3L; Supplier: Digikey; Supplier 1: DigiKey; Supplier Part Number 1: 311-3.30KLRCT-ND; Datasheet Link: https://yageogroup.com/content/datasheet/asset/file/PYU-RC_GROUP_51_ROHS_L
U15 = TCA9548ADGSR: IC BUS SWITCH 2 X 1:8 24-VSSOP; Manufacturer_Name: Texas Instruments; Datasheet Link: https://www.ti.com/lit/ds/symlink/tca9548a.pdf?ts=1738746169750&ref_url=https%253A%252F%252Fwww.mouser.de%252F; Height: 1.1mm; Manufacturer_Part_Number: TCA9548ADGSR; Mouser Part Number: 595-TCA9548ADGSR; Mouser Price/Stock: https://www.mouser.co.uk/ProductDetail/Texas-Instruments/TCA9548ADGSR?qs=olJun0bQHM%252B7USbLxm4jDw%3D%3D; Arrow Part Number: TCA9548ADGSR; Arrow Price/Stock: https://www.arrow.com/en/products/tca9548adgsr/texas-instruments.html?utm_currency=USD&region=nac; Supplier 1: Digikey; Supplier Part Number 1: 296-TCA9548ADGSRCT-ND; Value: TCA9548ADGSR
U16 = ISO1640BDR: Hot-swappable, robust-EMC bidirectional I2C isolator with bidirectional clock 8-SOIC -40 to 125; Manufacturer_Name: Texas Instruments; TYPE: TYPE; RefDes: RefDes; Copyright: Copyright (C) 2026 Ultra Librarian. All rights reserved.; Manufacturer_Part_Number: ISO1640BDR; Supplier 1: DigiKey; Supplier Part Number 1: 296-ISO1640BDRCT-ND; Value: ISO1640BDR; Datasheet Link: https://www.ti.com/lit/ds/symlink/iso1640.pdf